# EAGLE design SparkFun_Artemis_OpenLog (EAGLE 9.5.2)
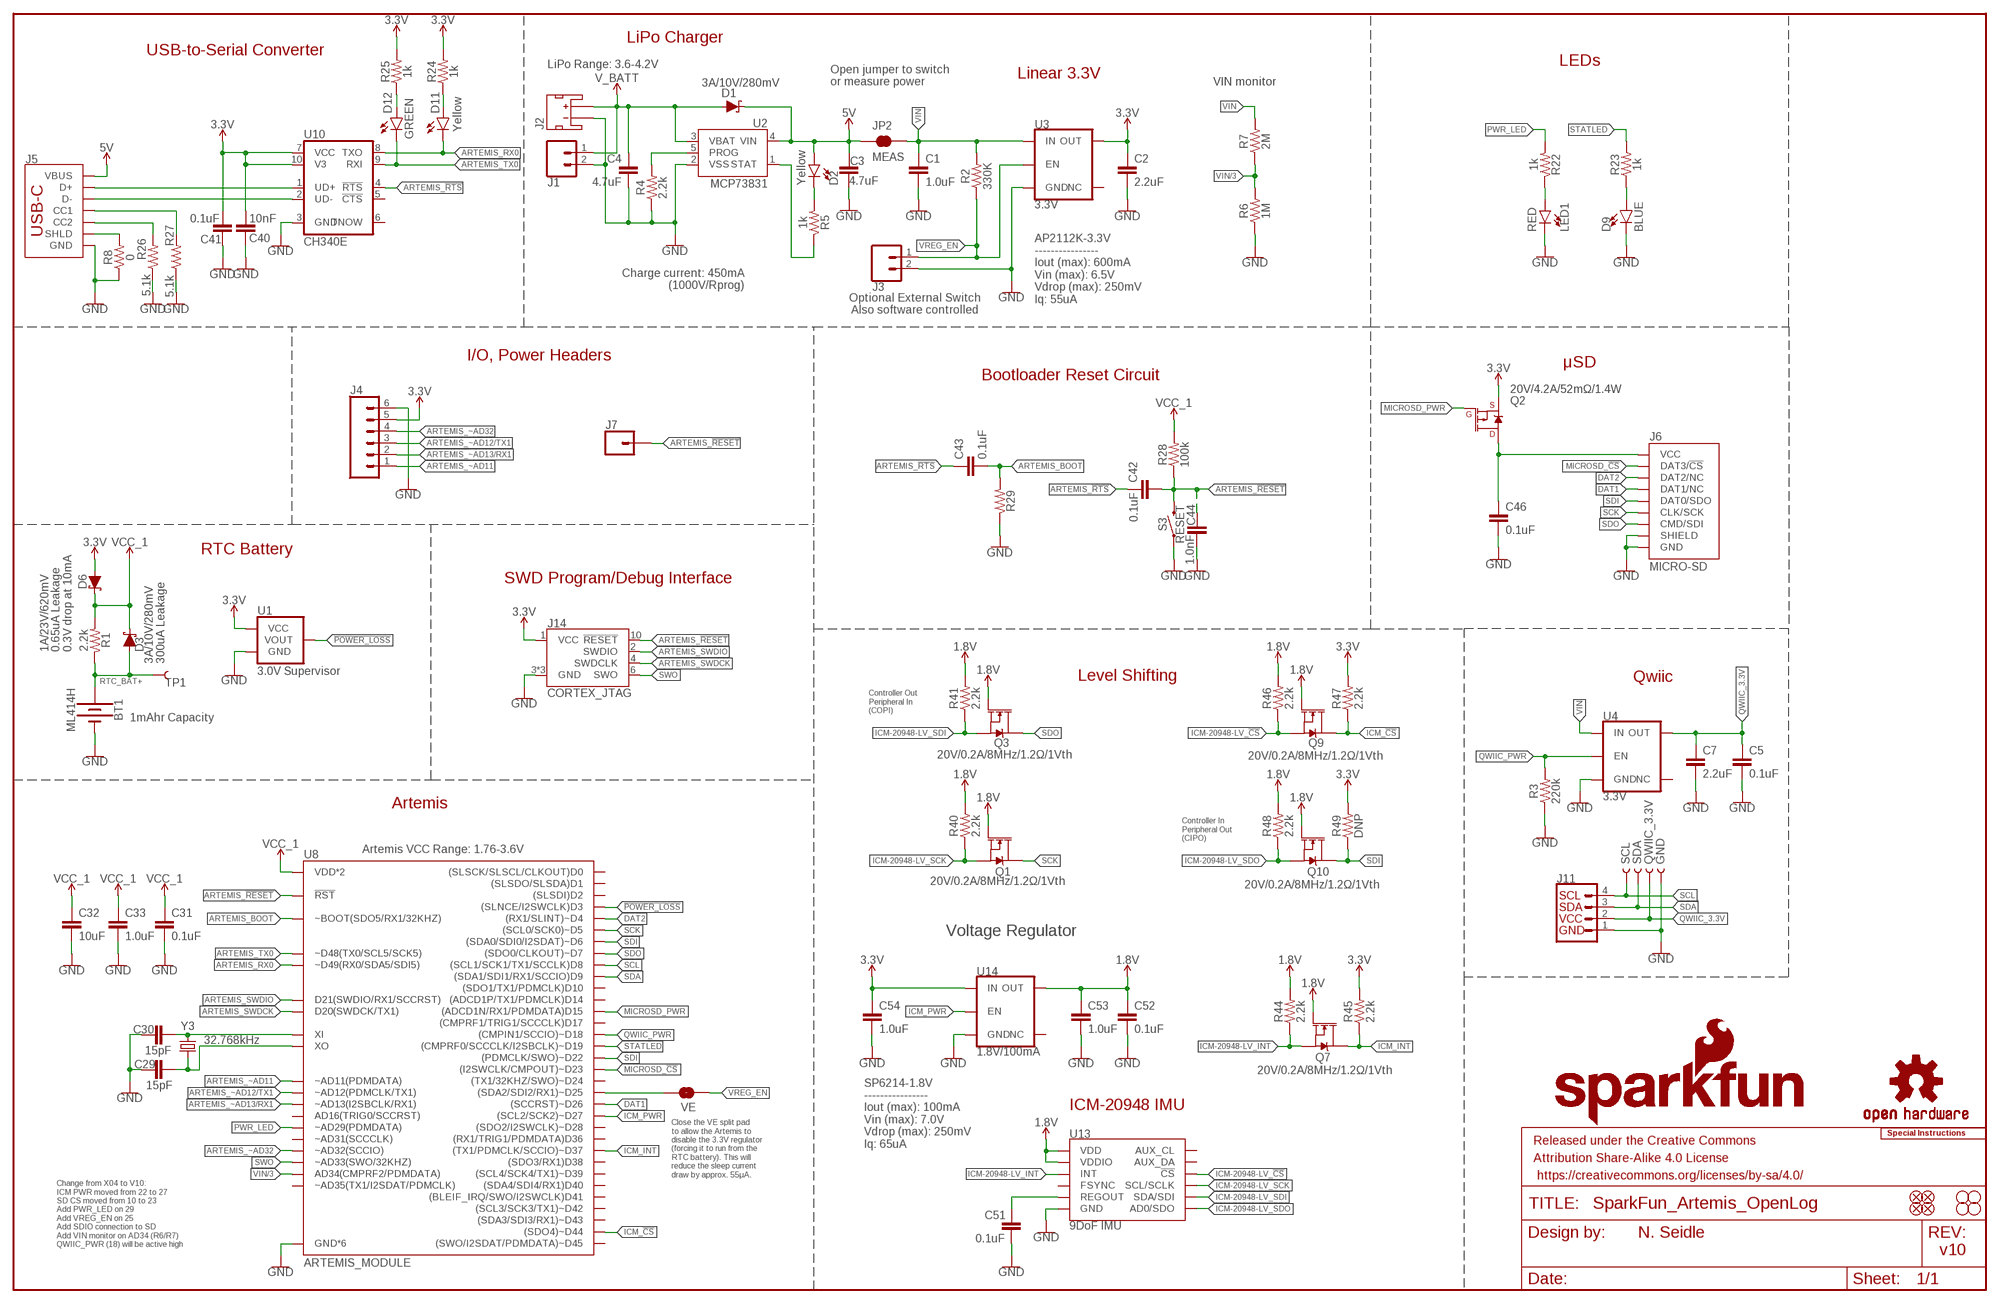
[diagram p0: schematic, sheet 1]

## Parts
BT1  ML414H  ML414H_IV01E_BATTERY  [ML414H_IV01E]
C1  1.0uF  1.0UF-0402T-16V-10%  [0402-TIGHT]
C2  2.2uF  2.2UF-0402_TIGHT-10V-10%-X5R  [0402-TIGHT]
C3  4.7uF  4.7UF-0402_TIGHT-6.3V-20%-X5R  [0402-TIGHT]
C4  4.7uF  4.7UF-0402_TIGHT-6.3V-20%-X5R  [0402-TIGHT]
C5  0.1uF  0.1UF-0402T-6.3V-10%-X7R  [0402-TIGHT]
C7  2.2uF  2.2UF-0402_TIGHT-10V-10%-X5R  [0402-TIGHT]
C29  15pF  15PF-0402T-50V-5%  [0402-TIGHT]
C30  15pF  15PF-0402T-50V-5%  [0402-TIGHT]
C31  0.1uF  0.1UF-0402T-16V-10%  [0402-TIGHT]
C32  10uF  10UF-0402T-6.3V-20%  [0402-TIGHT]
C33  1.0uF  1.0UF-0402T-16V-10%  [0402-TIGHT]
C40  10nF  10NF-0402T-25V-10%  [0402-TIGHT]
C41  0.1uF  0.1UF-0402T-16V-10%  [0402-TIGHT]
C42  0.1uF  0.1UF-0402T-16V-10%  [0402-TIGHT]
C43  0.1uF  0.1UF-0402T-16V-10%  [0402-TIGHT]
C44  1.0nF  1.0NF/1000PF-0402_TIGHT-50V-10%  [0402-TIGHT]
C46  0.1uF  0.1UF-0402T-16V-10%  [0402-TIGHT]
C51  0.1uF  0.1UF-0402T-16V-10%  [0402-TIGHT]
C52  0.1uF  0.1UF-0402T-16V-10%  [0402-TIGHT]
C53  1.0uF  1.0UF-0402T-16V-10%  [0402-TIGHT]
C54  1.0uF  1.0UF-0402T-16V-10%  [0402-TIGHT]
D1  3A/10V/280mV  DIODE-SCHOTTKY-BAT60A  [SOD-323]
D2  Yellow  LED-YELLOW0603  [LED-0603]
D3  3A/10V/280mV  DIODE-SCHOTTKY-BAT60A  [SOD-323]
D6  1A/23V/620mV  DIODE-SCHOTTKY-BAT20J  [SOD-323]
D9  BLUE  LED-BLUE0603  [LED-0603]
D11  Yellow  LED-YELLOW0603  [LED-0603]
D12  GREEN  LED-GREEN0603  [LED-0603]
FD1  FIDUCIAL1X2  [FIDUCIAL-1X2]
FD2  FIDUCIAL1X2  [FIDUCIAL-1X2]
FD3  FIDUCIAL1X2  [FIDUCIAL-1X2]
FD4  FIDUCIAL1X2  [FIDUCIAL-1X2]
FRAME1  FRAME-LEDGER  [CREATIVE_COMMONS]
GND  TEST-POINTTP_15TH_THRU  [TP_15TH]
H1  STAND-OFF  [STAND-OFF]
H2  STAND-OFF  [STAND-OFF]
H3  STAND-OFF  [STAND-OFF]
H4  STAND-OFF  [STAND-OFF]
J1  CONN_021X02_NO_SILK  [1X02_NO_SILK]
J2  JST_2MM_MALE  [JST-2-SMD]
J3  CONN_021X02_NO_SILK  [1X02_NO_SILK]
J4  CONN_06NO_SILK_NO_POP  [1X06_NO_SILK]
J5  USB_C_4-LAYER_PADS  [USB-C-16P_4LAYER-PADS]
J6  MICRO-SD  MICRO-SD-SDIOPUSH-PUSH  [MICRO-SD-SOCKET]
J7  CONN_01PTH_NO_SILK_YES_STOP  [1X01_NO_SILK]
J11  QWIIC_CONNECTORJS-1MM  [JST04_1MM_RA]
J14  CORTEX_JTAG  CORTEX_JTAG_DEBUG_MINIMUM_PTH  [2X5-PTH-1.27MM]
JP2  MEAS  JUMPER-COMBO_2_NC_TRACE  [COMBO-JUMPER_2_NC_TRACE]
LED1  RED  LED-RED0603  [LED-0603]
LOGO1  SFE_LOGO_NAME.1_INCH  [SFE_LOGO_NAME_.1]
LOGO2  OSHW-LOGOS  [OSHW-LOGO-S]
LOGO3  SPECIAL_INSTRUCTIONS-ORDERING  [ORDERING_INSTRUCTIONS]
LOGO4  SFE_LOGO_FLAME.1_INCH  [SFE_LOGO_FLAME_.1]
LOGO5  SFE_LOGO_FLAME.1_INCH  [SFE_LOGO_FLAME_.1]
Q1  20V/0.2A/8MHz/1.2Ω/1Vth  MOSFET-NCH-RE1C00UNTL  [SOT-416FL]
Q2  20V/4.2A/52mΩ/1.4W  MOSFET_PCH-DMG2305UX-7  [SOT23-3]
Q3  20V/0.2A/8MHz/1.2Ω/1Vth  MOSFET-NCH-RE1C00UNTL  [SOT-416FL]
Q7  20V/0.2A/8MHz/1.2Ω/1Vth  MOSFET-NCH-RE1C00UNTL  [SOT-416FL]
Q9  20V/0.2A/8MHz/1.2Ω/1Vth  MOSFET-NCH-RE1C00UNTL  [SOT-416FL]
Q10  20V/0.2A/8MHz/1.2Ω/1Vth  MOSFET-NCH-RE1C00UNTL  [SOT-416FL]
QWIIC_3.3V  TEST-POINTTP_15TH_THRU  [TP_15TH]
R1  2.2k  2.2KOHM-0402T-1/16W-1%  [0402-TIGHT]
R2  330K  330KOHM-0402T-1/16W-1%  [0402-TIGHT]
R3  220k  220KOHM-0402T-1/16W-1%  [0402-TIGHT]
R4  2.2k  2.2KOHM-0402T-1/16W-1%  [0402-TIGHT]
R5  1k  1KOHM-0402T-1/16W-1%  [0402-TIGHT]
R6  1M  1MOHM-0402T-1/16W-1%  [0402-TIGHT]
R7  2M  2MOHM-0402T-1/16W-1%  [0402-TIGHT]
R8  0  0OHM-0402T-1/10W  [0402-TIGHT]
R22  1k  1KOHM-0402T-1/16W-1%  [0402-TIGHT]
R23  1k  1KOHM-0402T-1/16W-1%  [0402-TIGHT]
R24  1k  1KOHM-0402T-1/16W-1%  [0402-TIGHT]
R25  1k  1KOHM-0402T-1/16W-1%  [0402-TIGHT]
R26  5.1k  5.1KOHM-0402T-1/16W-1%  [0402-TIGHT]
R27  5.1k  5.1KOHM-0402T-1/16W-1%  [0402-TIGHT]
R28  100k  100KOHM-0402T-1/16W-1%  [0402-TIGHT]
R29  220KOHM-0402T-1/16W-1%  [0402-TIGHT]
R40  2.2k  2.2KOHM-0402T-1/16W-1%  [0402-TIGHT]
R41  2.2k  2.2KOHM-0402T-1/16W-1%  [0402-TIGHT]
R44  2.2k  2.2KOHM-0402T-1/16W-1%  [0402-TIGHT]
R45  2.2k  2.2KOHM-0402T-1/16W-1%  [0402-TIGHT]
R46  2.2k  2.2KOHM-0402T-1/16W-1%  [0402-TIGHT]
R47  2.2k  2.2KOHM-0402T-1/16W-1%  [0402-TIGHT]
R48  2.2k  2.2KOHM-0402T-1/16W-1%  [0402-TIGHT]
R49  DNP  RESISTOR0402T  [0402-TIGHT]
S3  RESET  MOMENTARY-SWITCH-SPST-SMD-4.6X2.8MM  [TACTILE_SWITCH_SMD_4.6X2.8MM]
SCL  TEST-POINTTP_15TH_THRU  [TP_15TH]
SDA  TEST-POINTTP_15TH_THRU  [TP_15TH]
TP1  TEST-POINT3  [PAD.03X.03]
U1  3.0V Supervisor  V_SUPERVISOR  [SOT23-3]
U2  MCP73831  [SOT23-5]
U3  3.3V  V_REG_AP2112K-3.3V  [SOT23-5]
U4  3.3V  V_REG_AP2112K-3.3V  [SOT23-5]
U8  ARTEMIS_MODULE  ARTEMIS_MODULESMD  [ARTEMIS_FP]
U10  CH340E  CH340E_MSOP10  [MSOP10]
U13  9DoF IMU  ICM-20948  [QFN24-3X3-ICM-20948]
U14  1.8V/100mA  V_REG_SP6214-1.8V  [SC70]
VE  JUMPER-SMT_2_NO_SILK  [SMT-JUMPER_2_NO_SILK]
Y3  32.768kHz  CRYSTAL-32.768KHZSMD-3.2X1.5  [CRYSTAL-SMD-3.2X1.5MM]

## Nets
3.3V: C2.1 C40.1 C41.1 C54.1 D6.A J4.5 J14.1(VCC) Q2.2(S) R24.2 R25.2 R45.2 R47.2 R49.2 U1.3(VCC) U3.5(OUT) U10.7(VCC) U10.10(V3) U14.1(IN)
5V [Power]: C3.1 D1.C D2.A J5.VBUS1(VBUS) J5.VBUS2(VBUS) JP2.1 JP2.3 U2.4(VIN)
!POWER_LOSS!: U1.2(VOUT) U8.D3((SLNCE/I2SWCLK)D3)
ARTEMIS_!RESET: C42.2 C44.1 J7.1 J14.10(!RESET) R28.1 S3.3 S3.4 U8.~RST(!RST)
ARTEMIS_!RTS!: C42.1 C43.1 U10.4(!RTS)
ARTEMIS_BOOT: C43.2 R29.2 U8.BOOT(~BOOT(SDO5/RX1/32KHZ))
ARTEMIS_RX0: D11.C U8.RXI-0(~D49(RX0/SDA5/SDI5)) U10.8(TXO)
ARTEMIS_SWDCK: J14.4(SWDCLK) U8.SWDCK(D20(SWDCK/TX1))
ARTEMIS_SWDIO: J14.2(SWDIO) U8.SWDIO(D21(SWDIO/RX1/SCCRST))
ARTEMIS_TX0: D12.C U8.TXO-0(~D48(TX0/SCL5/SCK5)) U10.9(RXI)
ARTEMIS_~AD11: J4.1 U8.~AD11(~AD11(PDMDATA))
ARTEMIS_~AD12/TX1: J4.3 U8.~AD12(~AD12(PDMCLK/TX1))
ARTEMIS_~AD13/RX1: J4.2 U8.~AD13(~AD13(I2SBCLK/RX1))
ARTEMIS_~AD32: J4.4 U8.~AD32(~AD32(SCCIO))
CC3: J5.B5(CC2) R26.2
CC4: J5.A5(CC1) R27.2
CHG_LED: R5.1 U2.1(STAT)
D+2: J5.A6(D+) J5.B6(D+) U10.1(UD+)
D-2: J5.A7(D-) J5.B7(D-) U10.2(UD-)
DAT1: J6.DAT1(DAT1/NC) U8.~D26((SCCRST)~D26)
DAT2: J6.DAT2(DAT2/NC) U8.~D4((RX1/SLINT)~D4)
GND: BT1.- C1.2 C2.2 C3.2 C4.2 C5.2 C7.2 C29.1 C30.1 C31.1 C32.2 C33.2 C40.2 C41.2 C44.2 C46.2 C51.2 C52.2 C53.2 C54.2 D9.C GND.P$1 J1.2 J2.1(-) J3.2 J4.6 J5.GND J5.GND2(GND) J6.CD1(SHIELD) J6.GND J6.GND1(GND) J6.GND3(GND) J11.1 J14.3(GND) J14.5(GND) J14.9(GND) LED1.C R3.1 R4.1 R6.1 R8.1 R26.1 R27.1 R29.1 S3.1 S3.2 U1.1(GND) U2.2(VSS) U3.2(GND) U4.2(GND) U8.GND@1(GND*6) U8.GND@22(GND*6) U8.GND@38(GND*6) U8.GND@39(GND*6) U8.GND@47(GND*6) U8.GND@59(GND*6) U10.3(GND) U13.18(GND) U13.20(GND) U14.2(GND)
ICM-20948-LV_!CS!: Q9.2(S) R46.1 U13.22(!CS)
ICM-20948-LV_#_1.8V: C52.1 C53.1 Q1.1(G) Q3.1(G) Q7.1(G) Q9.1(G) Q10.1(G) R40.2 R41.2 R44.2 R46.2 R48.2 U13.8(VDDIO) U13.13(VDD) U14.5(OUT) ; supply symbol labelled 1.8V
ICM-20948-LV_INT: Q7.2(S) R44.1 U13.12(INT)
ICM-20948-LV_SCK: Q1.2(S) R40.1 U13.23(SCL/SCLK)
ICM-20948-LV_SDI: Q3.2(S) R41.1 U13.24(SDA/SDI)
ICM-20948-LV_SDO: Q10.2(S) R48.1 U13.9(AD0/SDO)
ICM_!CS!: Q9.3(D) R47.1 U8.~D44((SDO4)~D44)
ICM_INT: Q7.3(D) R45.1 U8.~D37((TX1/PDMCLK/SCCIO)~D37)
ICM_PWR: U8.~D27((SCL2/SCK2)~D27) U14.3(EN)
MICROSD_!CS!: J6.CS/DAT3(DAT3/!CS!) U8.~D23((I2SWCLK/CMPOUT)~D23)
MICROSD_PWR: Q2.1(G) U8.D15((ADCD1N/RX1/PDMDATA)D15)
N$1: J5.SHLD1(SHLD) J5.SHLD2(SHLD) J5.SHLD3(SHLD) J5.SHLD4(SHLD) R8.2
N$7: R4.2 U2.5(PROG)
N$11: D2.C R5.2
N$20: C29.2 U8.XO Y3.P$2
N$21: C30.2 U8.XI Y3.P$1
N$24: LED1.A R22.1
N$25: D9.A R23.1
N$26: D12.A R25.1
N$27: D11.A R24.1
N$30: C51.1 U13.10(REGOUT)
PWR_LED: R22.2 U8.~AD29(~AD29(PDMDATA))
QWIIC_3.3V: C5.1 C7.1 J11.2 QWIIC_3.3V.P$1 U4.5(OUT)
QWIIC_PWR: R3.2 U4.3(EN) U8.~D18((CMPIN1/SCCIO)~D18)
RTC_BAT+: BT1.+ D3.A R1.1 TP1.P$1
SCK: J6.SCLK(CLK/SCK) Q1.3(D) U8.~D5((SCL0/SCK0)~D5)
SCL: J11.4 SCL.P$1 U8.D8((SCL1/SCK1/TX1/SCCLK)D8)
SD_PWR: C46.1 J6.VCC Q2.3(D)
SDA: J11.3 SDA.P$1 U8.D9((SDA1/SDI1/RX1/SCCIO)D9)
SDI: J6.DO/DAT0(DAT0/SDO) Q10.3(D) R49.1 U8.~D6((SDA0/SDI0/I2SDAT)~D6) U8.~D22((PDMCLK/SWO)~D22)
SDO: J6.DI/CMD(CMD/SDI) Q3.3(D) U8.D7((SDO0/CLKOUT)~D7)
STATLED: R23.2 U8.~D19((CMPRF0/SCCCLK/I2SBCLK)~D19)
SWO: J14.6(SWO) U8.~AD33/SWO(~AD33(SWO/32KHZ))
V_BATT: C4.1 D1.A J1.1 J2.2(+) U2.3(VBAT)
VCC_1: C31.2 C32.1 C33.1 D3.C D6.C R1.2 R28.2 U8.VDD@36(VDD*2) U8.VDD@37(VDD*2)
VIN [Power]: C1.1 JP2.2 JP2.4 R2.2 R7.2 U3.1(IN) U4.1(IN)
VIN/3: R6.2 R7.1 U8.AD34(AD34(CMPRF2/PDMDATA))
VREG_EN: J3.1 R2.1 U3.3(EN) VE.2
VREG_EN1: U8.~D25((SDA2/SDI2/RX1)~D25) VE.1
Unconnected: J2.NC1(PAD1) J2.NC2(PAD2) U3.4(NC) U4.4(NC) U8.AD16(AD16(TRIG0/SCCRST)) U8.D0((SLSCK/SLSCL/CLKOUT)D0) U8.D1((SLSDO/SLSDA)D1) U8.D2((SLSDI)D2) U8.D10((SDO1/TX1/PDMCLK)D10) U8.D14((ADCD1P/TX1/PDMCLK)D14) U8.D17((CMPRF1/TRIG1/SCCCLK)D17) U8.D36((RX1/TRIG1/PDMDATA)D36) U8.D38((SDO3/RX1)D38) U8.D40((SDA4/SDI4/RX1)D40) U8.D41((BLEIF_IRQ/SWO/I2SWCLK)D41) U8.~AD31(~AD31(SCCCLK)) U8.~AD35(~AD35(TX1/I2SDAT/PDMCLK)) U8.~D24((TX1/32KHZ/SWO)~D24) U8.~D28((SDO2/I2SWCLK)~D28) U8.~D39((SCL4/SCK4/TX1)~D39) U8.~D42((SCL3/SCK3/TX1)~D42) U8.~D43((SDA3/SDI3/RX1)~D43) U8.~D45((SWO/I2SDAT/PDMDATA)~D45) U10.5(!CTS) U10.6(TNOW) U13.7(AUX_CL) U13.11(FSYNC) U13.21(AUX_DA) U14.4(NC)

## Notes on the sheet
- LiPo Charger
- USB-to-Serial Converter
- LiPo Range: 3.6-4.2V | LEDs
- Linear 3.3V
- Open jumper to switch
  or measure power
- VIN monitor
- AP2112K-3.3V
  ----------------
  Iout (max): 600mA
  Vin (max): 6.5V
  Vdrop (max): 250mV
  Iq: 55uA
- Charge current: 450mA
  (1000V/Rprog)
- Optional External Switch
  Also software controlled
- I/O, Power Headers
- μSD
- Bootloader Reset Circuit
- RTC Battery
- SWD Program/Debug Interface
- 0.65uA Leakage
  0.3V drop at 10mA
- 300uA Leakage
- Level Shifting | Qwiic
- Controller Out
  Peripheral In
  (COPI)
- 1mAhr Capacity
- Artemis
- Controller In
  Peripheral Out
  (CIPO)
- Artemis VCC Range: 1.76-3.6V
- Voltage Regulator
- SP6214-1.8V
  ----------------
  Iout (max): 100mA
  Vin (max): 7.0V
  Vdrop (max): 250mV
  Iq: 65uA
- ICM-20948 IMU
- Close the VE split pad
  to allow the Artemis to
  disable the 3.3V regulator
  (forcing it to run from the
  RTC battery). This will
  reduce the sleep current
  draw by approx. 55μA.
- N. Seidle
- Change from X04 to V10:
  ICM PWR moved from 22 to 27
  SD CS moved from 10 to 23
  Add PWR_LED on 29
  Add VREG_EN on 25
  Add SDIO connection to SD
  Add VIN monitor on AD34 (R6/R7)
  QWIIC_PWR (18) will be active high
- v10

## Library data of the parts
BT1 = SparkFun-Batteries:ML414H_IV01E_BATTERY: SEIKO ML414H-IV01E Reflowable Lithium Battery ML414H is a rechargeable, coin type battery with features such as Pb-free reflowable (Peak temperature: 260 C) and high temperature heat resistance. Battery Characteristics: 3.1V max voltage Voff is 2V 1mAH 3k series resistor with battery 72 hour charge time from 2.0-3.1V 2.3-2.8V initial charge; PROD_ID: BATT-14267
C1 C33 C53 C54 = SparkFun-Capacitors:1.0UF: 1µF ceramic capacitors A capacitor is a passive two-terminal electrical component used to store electrical energy temporarily in an electric field.; PROD_ID: CAP-12417
C2 C7 = SparkFun-Capacitors:2.2UF: 2.2µF ceramic capacitors A capacitor is a passive two-terminal electrical component used to store electrical energy temporarily in an electric field.; PROD_ID: CAP-14232
C3 C4 = SparkFun-Capacitors:4.7UF: 4.7µF ceramic capacitors A capacitor is a passive two-terminal electrical component used to store electrical energy temporarily in an electric field.; PROD_ID: CAP-14240
C5 = SparkFun-Capacitors:0.1UF: 0.1µF ceramic capacitors A capacitor is a passive two-terminal electrical component used to store electrical energy temporarily in an electric field.; PROD_ID: CAP-14993
C29 C30 = SparkFun-Capacitors:15PF: 15pF ceramic capacitors A capacitor is a passive two-terminal electrical component used to store electrical energy temporarily in an electric field.; PROD_ID: CAP-13063
C31 C41-C43 C46 C51 C52 = SparkFun-Capacitors:0.1UF: 0.1µF ceramic capacitors A capacitor is a passive two-terminal electrical component used to store electrical energy temporarily in an electric field.; PROD_ID: CAP-12416
C32 = SparkFun-Capacitors:10UF: 10.0µF ceramic capacitors A capacitor is a passive two-terminal electrical component used to store electrical energy temporarily in an electric field.; PROD_ID: CAP-14848
C40 = SparkFun-Capacitors:10NF: 0.01uF/10nF/10,000pF ceramic capacitors A capacitor is a passive two-terminal electrical component used to store electrical energy temporarily in an electric field. CAP-09321; PROD_ID: CAP-14847
C44 = SparkFun-Capacitors:1.0NF/1000PF: 1nF/1,000pF ceramic capacitors A capacitor is a passive two-terminal electrical component used to store electrical energy temporarily in an electric field.; PROD_ID: CAP-14280
D1 D3 = SparkFun-DiscreteSemi:DIODE-SCHOTTKY: Schottky diode A Schottky diode is a semiconductor diode which has a low forward voltage drop and a very fast switching action.; PROD_ID: DIO-14072
D2 D11 = SparkFun-LED:LED-YELLOW: Yellow SMD LED Used in manufacturing several products at SparkFun. Packages: 0603 - SMD 0603 package[Product Link] <http://www.kingbrightusa.com/product.asp?catalog_name=LED&product_id=APT1608SYCK> 0603 -SMART - SMART SMD 0603 package (more efficient/more expensive) [Product Link] <http://www.osram-os.com/osram_os/en/products/product-catalog/led-light-emitting-diodes/smartled-0603/ly-l29k/index.jsp> LilyPad - SMD1206 package[Product Datasheet] <https://www.sparkfun.com/datasheets/DevTools/LilyPad/Q150YUS4.pdf> SparkFun Products: Blynk Board <https://www.sparkfun.com/products/13794> IOIO-OTG <https://www.sparkfun.com/products/13613> XBee Explorer Serial <https://www.sparkfun.com/products/13225>; PROD_ID: DIO-09003
D6 = SparkFun-DiscreteSemi:DIODE-SCHOTTKY: Schottky diode A Schottky diode is a semiconductor diode which has a low forward voltage drop and a very fast switching action.; PROD_ID: DIO-11623
D9 = SparkFun-LED:LED-BLUE: Blue SMD LED Used in manufacturing of various products at SparkFun Packages: 0603 - SMD 0603 package [Product Link] <http://www.digikey.com/product-detail/en/SMLE12BC7TT86/511-1589-2-ND/1641808> 1206 - SMD1206 package [Product Link] <http://www.digikey.com/product-detail/en/lite-on-inc/LTST-C150TBKT/160-1643-1-ND/573584> SparkFun Products: ESP8266 Thing-Dev Board <https://www.sparkfun.com/products/13711> RedBoard <https://www.sparkfun.com/products/12757>; PROD_ID: DIO-08575
D12 = SparkFun-LED:LED-GREEN: Green SMD LED Used in manufacturing of various products at SparkFun Packages: 0603 - SMD 0603 package [Product Link] <http://www.futureelectronics.com/en/technologies/semiconductors/optoelectronics/leds/Pages/9894312-LTST-C190GKT.aspx?CrossPart=HSMG-C190&IM=0> LilyPad 1206 - SMD1206 LilyPad package [Product Link] <http://www.futureelectronics.com/en/Technologies/Product.aspx?ProductID=IN150NGHARVATEKCORPORATION2049943&IM=0> 1206 - SMD1206 package [Product Link] <http://www.futureelectronics.com/en/technologies/semiconductors/optoelectronics/leds/Pages/8315665-LTST-C150KGKT.aspx?IM=0> 1206 Bottom Mount -SMD 1206 Bottom Mount [Product Link] <http://www.digikey.com/product-detail/en/lite-on-inc/LTST-C230KGKT/160-1456-1-ND/386854> SparkFun Products: Pro Mini 328 -5V <https://www.sparkfun.com/products/821> RedBoard <https://www.sparkfun.com/products/12757> MP3 Trigger <https://www.sparkfun.com/products/13720> Makey Makey <https://www.sparkfun.com/products/11076>; PROD_ID: DIO-00821
FD1-FD4 = SparkFun-Aesthetics:FIDUCIAL: Fiducial Alignment Points Point-of-reference for pick-and-place machines and other optical instruments.
FRAME1 = SparkFun-Aesthetics:FRAME-LEDGER: Schematic Frame - Ledger Standard 11x14 US Ledger frame
GND QWIIC_3.3V SCL SDA TP1 = SparkFun-Connectors:TEST-POINT: SparkFun Test Points Bare copper test points for troubleshooting or In-Circuit-Testing. These are used by our Production team for verifying production board runs using pogo-pins on test beds. SparkFun Products: SparkFun LSM9DS1 Breakout <https://www.sparkfun.com/products/13284> SparkFun PSOC <https://www.sparkfun.com/products/13714> SparkFun Load Cell Amplifier <https://www.sparkfun.com/products/13879>
H1-H4 = SparkFun-Hardware:STAND-OFF: Stand Off Drill holes for mechanically mounting via screws, standoffs, etc. Note: Use the keepout ring to avoid running the screw head into surrounding components. Variant Overviews STAND-OFF - Mechanical footprint for a #4 phillips button head screw. STAND-OFF-TIGHT - Mechanical footprint for a #4 phillips button head screw, Example SparkFun Products Screw - Phillips Head (1/4", 4-40, 10 pack) <https://www.sparkfun.com/products/10453> (PRT-10453) Screw - Phillips Head (1/2", 4-40, 10 pack) <https://www.sparkfun.com/products/10452> (PRT-10452) Screw - Phillips Head (3/4", 4-40, 10 pack) <https://www.sparkfun.com/products/10451> (PRT-10451) Screw - Phillips Head (1", 4-40, 10 pack) <https://www.sparkfun.com/products/10450> (PRT-10450)
J1 J3 = SparkFun-Connectors:CONN_02: Multi connection point. Often used as Generic Header-pin footprint for 0.1 inch spaced/style header connections On any of the 0.1 inch spaced packages, you can populate with these: Break Away Headers - Straight <https://www.sparkfun.com/products/116> (PRT-00116) Break Away Male Headers - Right Angle <https://www.sparkfun.com/products/553> (PRT-00553) Female Headers <https://www.sparkfun.com/products/115> (PRT-00115) Break Away Headers - Machine Pin <https://www.sparkfun.com/products/117> (PRT-00117) Break Away Female Headers - Swiss Machine Pin <https://www.sparkfun.com/products/743> (PRT-00743) For SCREWTERMINALS and SPRING TERMINALS visit here: Screw Terimnals on SparkFun.com <https://www.sparkfun.com/search/results?term=Screw+Terminals> (5mm/3.5mm/2.54mm spacing) This device is also useful as a general connection point to wire up your design to another part of your project. Our various solder wires solder well into these plated through hole pads. Hook-Up Wire - Assortment (Stranded, 22 AWG) <https://www.sparkfun.com/products/11375> (PRT-11375) Hook-Up Wire - Assortment (Solid Core, 22 AWG) <https://www.sparkfun.com/products/11367> (PRT-11367) View the entire wire category on our website here <https://www.sparkfun.com/categories/141> Special notes: Molex polarized connector foot print use with: PRT-08233 with associated crimp pins and housings. 2.54_SCREWTERM for use with PRT-10571. 3.5mm Screw Terminal footprints for PRT-08084 5mm Screw Terminal footprints for use with PRT-08432
J2 = SparkFun-Connectors:JST_2MM_MALE: JST 2MM MALE RA CONNECTOR Two pin, compact surface mount connector. Commonly used as a battery input connection point. We really like the solid locking feeling and high current rating on these small connectors. We use these all the time as battery connectors. Mates to single-cell LiPo batteries. Here is the connector we sell at SparkFun: JST Right Angle Connector - White <https://www.sparkfun.com/products/8612> (PRT-08612) Datasheet <http://www.sparkfun.com/datasheets/Prototyping/Connectors/JST-Horizontal.pdf> It was used on these SparkFun products: SparkFun MOSFET Power Controller <https://www.sparkfun.com/products/11214> (PRT-11214) SparkFun Battery Babysitter - LiPo Battery Manager <https://www.sparkfun.com/products/13777> (PRT-13777) And many, many others that required a lipo battery connection.; PROD_ID: CONN-11443; SF_ID: PRT-08612
J4 = SparkFun-Connectors:CONN_06: Multi connection point. Often used as Generic Header-pin footprint for 0.1 inch spaced/style header connections On any of the 0.1 inch spaced packages, you can populate with these: Break Away Headers - Straight <https://www.sparkfun.com/products/116> (PRT-00116) Break Away Male Headers - Right Angle <https://www.sparkfun.com/products/553> (PRT-00553) Female Headers <https://www.sparkfun.com/products/115> (PRT-00115) Break Away Headers - Machine Pin <https://www.sparkfun.com/products/117> (PRT-00117) Break Away Female Headers - Swiss Machine Pin <https://www.sparkfun.com/products/743> (PRT-00743) Arduino Stackable Header - 6 Pin <https://www.sparkfun.com/products/9280> (PRT-09280) For SCREWTERMINALS and SPRING TERMINALS visit here: Screw Terimnals on SparkFun.com <https://www.sparkfun.com/search/results?term=Screw+Terminals> (5mm/3.5mm/2.54mm spacing) This device is also useful as a general connection point to wire up your design to another part of your project. Our various solder wires solder well into these plated through hole pads. Hook-Up Wire - Assortment (Stranded, 22 AWG) <https://www.sparkfun.com/products/11375> (PRT-11375) Hook-Up Wire - Assortment (Solid Core, 22 AWG) <https://www.sparkfun.com/products/11367> (PRT-11367) View the entire wire category on our website here <https://www.sparkfun.com/categories/141>
J5 = SparkFun-Connectors:USB_C: USB Type C 16Pin Connector Super Speed pins not available on the 16-pin purely SMD connector so this part is best for USB 2.0 implementations. D1 and D2 are tied together enabling D+/- no matter which way the cable is plugged into the connector. The two channel configuration pins (CC1/2) are exposed. These are normally connected to ground via 5.1k resistors but can be reconfigured for high current/high power applications.; PROD_ID: CONN-14122
J6 = SparkFun-Connectors:MICRO-SD-SDIO: microSD Socket for Transflash Push-push type µSD socket. tDoc lines correctly indicate media card edge positions when inserting (unlocked, locked, depressed). NOTE: CD1 and CD2 are connected internally, and the default detect state of the socket is detect pin to ground. SparkFun Products: WAV Trigger <https://www.sparkfun.com/products/13660> CAN-Bus Shield <https://www.sparkfun.com/products/13262> SparkFun Level Shifing microSD Breakout <https://www.sparkfun.com/products/13743>; PROD_ID: CONN-07820
J7 = SparkFun-Connectors:CONN_01: Single connection point. Often used as Generic Header-pin footprint for 0.1 inch spaced/style header connections On any of the 0.1 inch spaced packages, you can populate with these: Break Away Headers - Straight <https://www.sparkfun.com/products/116> (PRT-00116) Break Away Male Headers - Right Angle <https://www.sparkfun.com/products/553> (PRT-00553) Female Headers <https://www.sparkfun.com/products/115> (PRT-00115) Break Away Headers - Machine Pin <https://www.sparkfun.com/products/117> (PRT-00117) Break Away Female Headers - Swiss Machine Pin <https://www.sparkfun.com/products/743> (PRT-00743) This device is also useful as a general connection point to wire up your design to another part of your project. Our various solder wires solder well into these plated through hole pads. Hook-Up Wire - Assortment (Stranded, 22 AWG) <https://www.sparkfun.com/products/11375> (PRT-11375) Hook-Up Wire - Assortment (Solid Core, 22 AWG) <https://www.sparkfun.com/products/11367> (PRT-11367) View the entire wire category on our website here <https://www.sparkfun.com/categories/141> Special notes: SMTSO-256-ET is a "flush mount" nut for a 4-40 screw. We mostly use this on specialty testbeds; it is a nice way to connect hardware to your PCB at an adjustable hieght. Also note, the SNAP packages are for using a snappable style connector. We sell a baggie of snaps and they are also used on two LilyPad designs: Snap Assortment - 30 pack (male and female) <https://www.sparkfun.com/products/11347> (DEV-11347) LilyPad Arduino SimpleSnap <https://www.sparkfun.com/products/10941> (DEV-10941) LilyPad SimpleSnap Protoboard <https://www.sparkfun.com/products/10940> (DEV-10940)
J11 = SparkFun-Connectors:QWIIC_CONNECTOR: SparkFun I2C Standard Qwiic Connector An SMD 1mm pitch JST connector makes it easy and quick (get it? Qwiic?) to connect I2C devices to each other. The Qwiic system <http://www.sparkfun.com/qwiic> enables fast and solderless connection between popular platforms and various sensors and actuators. We carry 200mm <https://www.sparkfun.com/products/14204>, 100mm <https://www.sparkfun.com/products/14205>, 50mm <https://www.sparkfun.com/products/14206>, and breadboard friendly <https://www.sparkfun.com/products/14207> Qwiic cables. We also offer 10 pcs strips <https://www.sparkfun.com/products/14323> the SMD connectors.; PROD_ID: CONN-13694; VALUE: QWIIC_RIGHT_ANGLE
J14 = SparkFun-Connectors:CORTEX_JTAG_DEBUG_MINIMUM: Cortex Debug Connector - 10 pin Supports JTAG debug, Serial Wire debug, and Serial Wire Viewer. PTH and SMD connector options available. General Connector Information <http://infocenter.arm.com/help/topic/com.arm.doc.faqs/attached/13634/cortex_debug_connectors.pdf> Products: PTH Connector <http://www.digikey.com/product-detail/en/cnc-tech/3220-10-0100-00/1175-1627-ND/3883661> -via Digi-Key SparkFun PSoc <https://www.sparkfun.com/products/13229> SparkFun T <https://www.sparkfun.com/products/13810>
JP2 = SparkFun-Jumpers:JUMPER-COMBO_2_NC_TRACE
LED1 = SparkFun-LED:LED-RED: Red SMD LED Used in manufacturing of most products at SparkFun Packages: 0603 - SMD 0603 package [Product Link] <http://docs.avagotech.com/docs/AV02-0551EN> 0603 SMART - SMD 0603 SMART package ( more efficient and expensive)[Product Link] <http://www.osram-os.com/Graphics/XPic2/00077099_0.pdf> 1206 - SMD1206 package [Product Link] <https://www.sparkfun.com/datasheets/DevTools/LilyPad/Q150OVS4.pdff> SparkFun Products: Pro Mini 328 -5V <https://www.sparkfun.com/products/821> RedBoard <https://www.sparkfun.com/products/12757> IOIO-OTG <https://www.sparkfun.com/products/13613>; PROD_ID: DIO-00819
LOGO1 = SparkFun-Aesthetics:SFE_LOGO_NAME: SparkFun Font Logo This is the SparkFun name logo. The logo on the schematic will always be the same size; the package variant is the height of the flame part of the logo (or the height the flame would be, if it were drawn). Default layer for the logo on the board is tSilk.
LOGO2 = SparkFun-Aesthetics:OSHW-LOGO: Open-Source Hardware (OSHW) Logo This logo indicates the piece of hardware it is found on incorporates a OSHW license and/or adheres to the definition of open source hardware found here: http://freedomdefined.org/OSHW
LOGO3 = SparkFun-Aesthetics:SPECIAL_INSTRUCTIONS: Special Ordering/Production Instructions Alert Symbol for special PCB ordering instructions or unique production process warnings. Ordering Instructions Production Instructions Types of information that should be added to box: Copper weight Soldermask color Silk color PCB thickness Number of layers PCB Standard: 1.6mm FR4 1 oz copper immersion silver plating red soldermask white silkscreen Types of information that should be added to box: Special wash requirements Depaneling instructions Humidification Glue curing Default text settings: 0.07 inch 9% ratio 50% line distance
LOGO4 LOGO5 = SparkFun-Aesthetics:SFE_LOGO_FLAME: SparkFun Flame Logo This is the SparkFun flame logo. The logo on the schematic will always be the same size; the package variant is the height of the flame. Default layer for the logo on the board is tSilk.
Q1 Q3 Q7 Q9 Q10 = SparkFun-DiscreteSemi:MOSFET-NCH: N-channel MOSFETs Voltage controlled devices that allow control of high current outputs. SparkFun Products: SparkFun OpenScale <https://www.sparkfun.com/products/13261> SparkFun Digital Sandbox <https://www.sparkfun.com/products/12651> SparkFun Monster Moto Shield <https://www.sparkfun.com/products/10182> SparkFun MOSFET Power Controller <https://www.sparkfun.com/products/11214>; PROD_ID: TRANS-14399
Q2 = SparkFun-DiscreteSemi:MOSFET_PCH: P-channel MOSFETs Voltage controlled devices that allow control of high current outputs. SparkFun Products: SparkFun ESP32 Thing <https://www.sparkfun.com/products/13907> SparkFun ESP8266 Thing <https://www.sparkfun.com/products/13231> SparkFun Pi Servo HAT V2 <https://www.sparkfun.com/products/15316> DMG2305UX-7 (20V/4.2A/SOT23-3); PROD_ID: TRAN-14388
R1 R4 R40 R41 R44-R48 = SparkFun-Resistors:2.2KOHM: 2.2kΩ resistor A resistor is a passive two-terminal electrical component that implements electrical resistance as a circuit element. Resistors act to reduce current flow, and, at the same time, act to lower voltage levels within circuits. - Wikipedia; PROD_ID: RES-14341
R2 = New_Parts:330KOHM: 330kΩ resistor A resistor is a passive two-terminal electrical component that implements electrical resistance as a circuit element. Resistors act to reduce current flow, and, at the same time, act to lower voltage levels within circuits. - Wikipedia; PROD_ID: RES-15187
R3 R29 = SparkFun-Resistors:220KOHM: 220kΩ resistor A resistor is a passive two-terminal electrical component that implements electrical resistance as a circuit element. Resistors act to reduce current flow, and, at the same time, act to lower voltage levels within circuits. - Wikipedia; PROD_ID: RES-15094
R5 R22-R25 = SparkFun-Resistors:1KOHM: 1kΩ resistor A resistor is a passive two-terminal electrical component that implements electrical resistance as a circuit element. Resistors act to reduce current flow, and, at the same time, act to lower voltage levels within circuits. - Wikipedia; PROD_ID: RES-14342
R6 = New_Parts:1MOHM: 1MΩ resistor A resistor is a passive two-terminal electrical component that implements electrical resistance as a circuit element. Resistors act to reduce current flow, and, at the same time, act to lower voltage levels within circuits. - Wikipedia; PROD_ID: RES-15185
R7 = New_Parts:2MOHM: 2MΩ resistor A resistor is a passive two-terminal electrical component that implements electrical resistance as a circuit element. Resistors act to reduce current flow, and, at the same time, act to lower voltage levels within circuits. - Wikipedia; PROD_ID: RES-15186
R8 = SparkFun-Resistors:0OHM: 0Ω resistor A resistor is a passive two-terminal electrical component that implements electrical resistance as a circuit element. Resistors act to reduce current flow, and, at the same time, act to lower voltage levels within circuits. - Wikipedia; PROD_ID: RES-14244
R26 R27 = SparkFun-Resistors:5.1KOHM; PROD_ID: RES-14340
R28 = SparkFun-Resistors:100KOHM: 100kΩ resistor A resistor is a passive two-terminal electrical component that implements electrical resistance as a circuit element. Resistors act to reduce current flow, and, at the same time, act to lower voltage levels within circuits. - Wikipedia; PROD_ID: RES-13495
R49 = SparkFun-Resistors:RESISTOR: Generic Resistor Package
S3 = SparkFun-Switches:MOMENTARY-SWITCH-SPST: Momentary Switch (Pushbutton) - SPST Normally-open (NO) SPST momentary switches (buttons, pushbuttons). Variants PTH-12MM - 12mm square, through-hole Momentary Pushbutton Switch - 12mm Square <https://www.sparkfun.com/products/9190> (COM-09190) PTH-6.0MM, PTH-6.0MM-KIT - 6.0mm square, through-hole Mini Pushbutton Switch <https://www.sparkfun.com/products/97> (COM-00097) KIT package intended for soldering kit's - only one side of pads' copper is exposed. PTH-RIGHT-ANGLE-KIT - Right-angle, through-hole Right Angle Tactile Button <https://www.sparkfun.com/products/10791> - Used on SparkFun BigTime Watch Kit <https://www.sparkfun.com/products/11734> SMD-12MM - 12mm square, surface-mount Tactile Button - SMD (12mm) <https://www.sparkfun.com/products/12993> (COM-12993) Used on SparkFun PicoBoard <https://www.sparkfun.com/products/11888> SMD-4.5MM - 4.5mm Square Trackball Switch Used on SparkFun Blackberry Trackballer Breakout <https://www.sparkfun.com/products/13169> SMD-4.6MMX2.8MM - 4.60mm x 2.80mm, surface mount Used on SparkFun SAMD21 Mini Breakout <https://www.sparkfun.com/products/13664> SMD-5.2MM, SMD-5.2-REDUNDANT - 5.2mm square, surface-mount Mini Pushbutton Switch - SMD <https://www.sparkfun.com/products/8720> (COM-08720) Used on Arduino Pro Mini <https://www.sparkfun.com/products/11114> REDUNDANT package connects both switch circuits together SMD-6.0X3.5MM - 6.0 x 3.5mm, surface mount Momentary Reset Switch SMD <https://www.sparkfun.com/products/8229> (COM-08229) SMD-6.2MM-TALL - 6.2mm square, surface mount Tactile Button - SMD (6mm) <https://www.sparkfun.com/products/12992> Used on SparkFun Digital Sandbox <https://www.sparkfun.com/products/12651> SMD-RIGHT-ANGLE - Right-angle, surface mount Used on SparkFun Block for Intel® Edison - Arduino <https://www.sparkfun.com/products/13036>; PROD_ID: SWCH-13065
U1 = SparkFun-IC-Power:V_SUPERVISOR: BD48xxx - Voltage Detector IC ROHM’s BD48xxx and BD49xxx series are highly accurate, low-current Voltage Detector IC series. The family includes BD48xxx devices with N-channel open drain output and BD49xxx devices with CMOS output. The devices are available for specific detection voltages ranging from 2.3V to 6.0V in increments of 0.1V.; PROD_ID: IC-14809
U2 = SparkFun-IC-Power:MCP73831: MCP73831T Li-Ion, Li-Pol Controller Miniature single cell, fully integrated Li-Ion, Li-polymer charge management controller Datasheet <http://ww1.microchip.com/downloads/en/DeviceDoc/20001984g.pdf> SparkFun Products: SparkFun ESP32 Thing <https://www.sparkfun.com/products/13907> SparkFun 9DoF Razor IMU M0 <https://www.sparkfun.com/products/14001>; PROD_ID: IC-09995
U3 U4 = SparkFun-IC-Power:V_REG_AP2112: AP2112 - 600mA CMOS LDO Regulator w/ Enable The AP2112 is CMOS process low dropout linear regulator with enable function, the regulator delivers a guaranteed 600mA (min.) continuous load current. Features Output Voltage Accuracy: ±1.5% Output Current: 600mA (Min.) Foldback Short Current Protection: 50mA Enable Function to Turn ON/OFF VOUT Low Dropout Voltage (3.3V): 250mV (Typ.) @IOUT=600mA Excellent Load Regulation: 0.2%/A (Typ.) Excellent Line Regulation: 0.02%/V (Typ.) Low Quiescent Current: 55μA (Typ.) Low Standby Current: 0.01μA (Typ.) Low Output Noise: 50μVRMS PSRR: 100Hz -65dB, 1kHz -65dB OTSD Protection Stable with 1.0μF Flexible Cap: Ceramic, Tantalum and Aluminum Electrolytic Operation Temperature Range: -40°C to 85°C ESD: MM 400V, HBM 4000V; PROD_ID: VREG-12457
U8 = SparkFun-IC-Microcontroller:ARTEMIS_MODULE: Description: The Artemis Module from SparkFun is a Cortex-M4F with BLE 5.0 running up to 96MHz and with as low power as 6uA per MHz (less than 5mW). This is the world's first module to bridge the market between hobbyists and consumer products. We've packaged all the power of a modern microcontroller into a module that is both extremely easy to use but is mass-market ready. The flexibility of the Artemis module starts with our [Arduino core](https://github.com/sparkfun/Arduino_Apollo3). You can program and use the Artemis module just like you would an Uno or any other Arduino. Time to first blink is just 5 minutes away! We built the core from the ground up, making it fast and as light weight as possible.; PROD_ID: SUB-14402
U10 = SparkFun-IC-Comms:CH340E; PROD_ID: IC-14135
U13 = SparkFun-Sensors:ICM-20948: ICM-20948 9 Degree of Freedom IMU World’s lowest power 9-axis MotionTracking device that is ideally suited for smartphones, tablets, wearable sensors, and IoT applications. Includes onboard Digital Motion Processor to offload computations from the host processor Datasheet <https://cdn.sparkfun.com/assets/learn_tutorials/5/5/0/MPU9250REV1.0.pdf> SparkFun Products: SparkFun IMU Breakout - ICM-20948 <https://www.sparkfun.com/products/15182>; PROD_ID: IC-14247
U14 = SparkFun-IC-Power:V_REG_SP6214: Voltage Regulator - SP6214 SP6214 Series SC-70-5 Micropower SC-70 100 mA CMOS LDO Regulator Datasheet <https://www.exar.com/content/document.ashx?id=654> SparkFun Products: MP3 Trigger <https://www.sparkfun.com/products/13720> SparkFun Particle Sensor Breakout <https://www.sparkfun.com/products/14045>; PROD_ID: VREG-08428
VE = SparkFun-Jumpers:JUMPER-SMT_2_NO: Normally open jumper This jumper has two pads in close proximity to each other. Apply solder to close the connection. Round pads are easier to solder for beginners, but are a lot larger. SparkFun Product that uses the round pads: SparkFun EL Sequencer <https://www.sparkfun.com/products/12781>
Y3 = SparkFun-Clocks:CRYSTAL-32.768KHZ: 32.768kHz Crystal Frequency: 32.768kHz Frequency Stability: ±20ppm Load Capacitance: 12.5pF (PTH-2X6 & SMD-3.2X1.5), 6pF (SMD-2X6) SparkFun Products: SparkFun BigTime Watch Kit <https://www.sparkfun.com/products/11734> SparkFun nRF52832 Breakout <https://www.sparkfun.com/products/13990> SparkFun Real Time Clock Module <https://www.sparkfun.com/products/12708>; PROD_ID: XTAL-13062

## Net classes
1 Power: width 0.457 mm

## Board
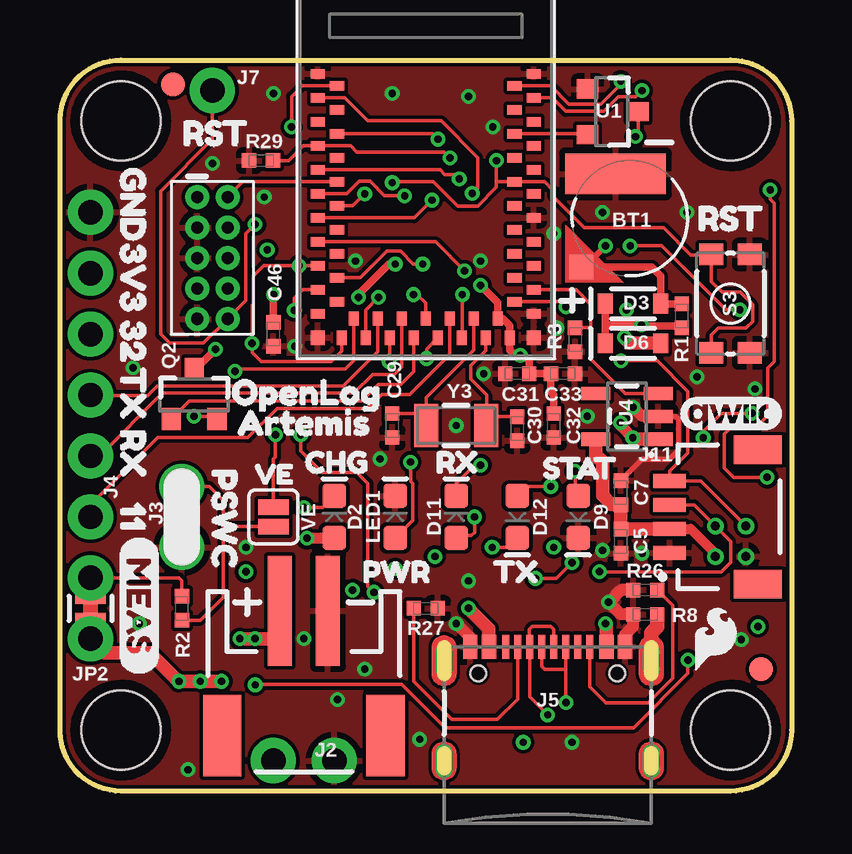
[diagram p1: board, top side]
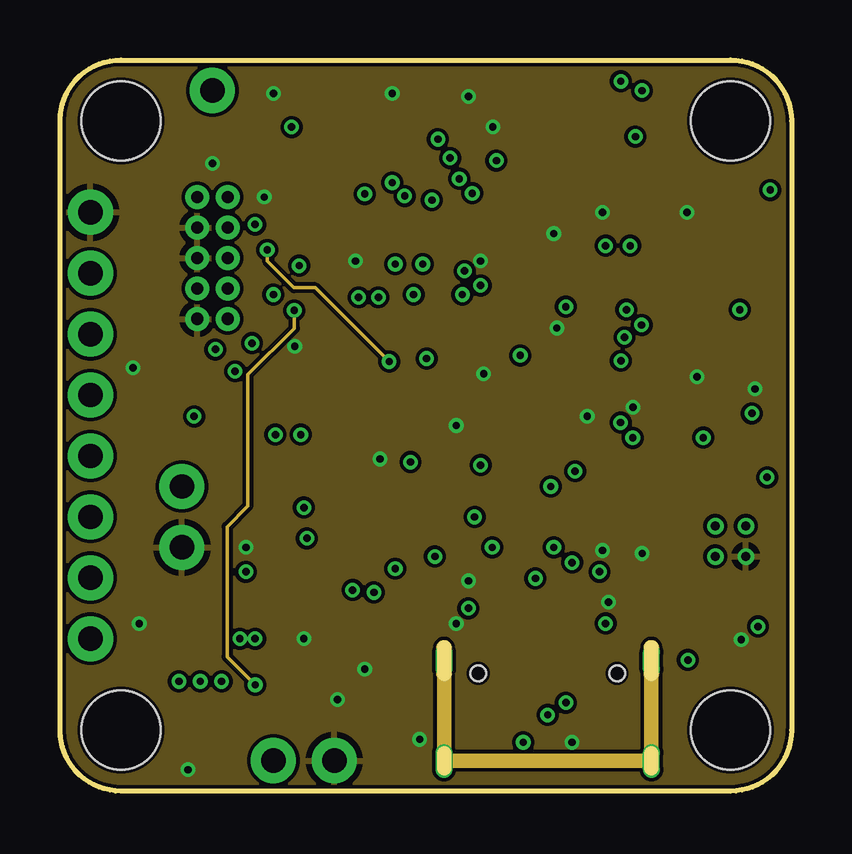
[diagram p2: board, inner layer Vertical]
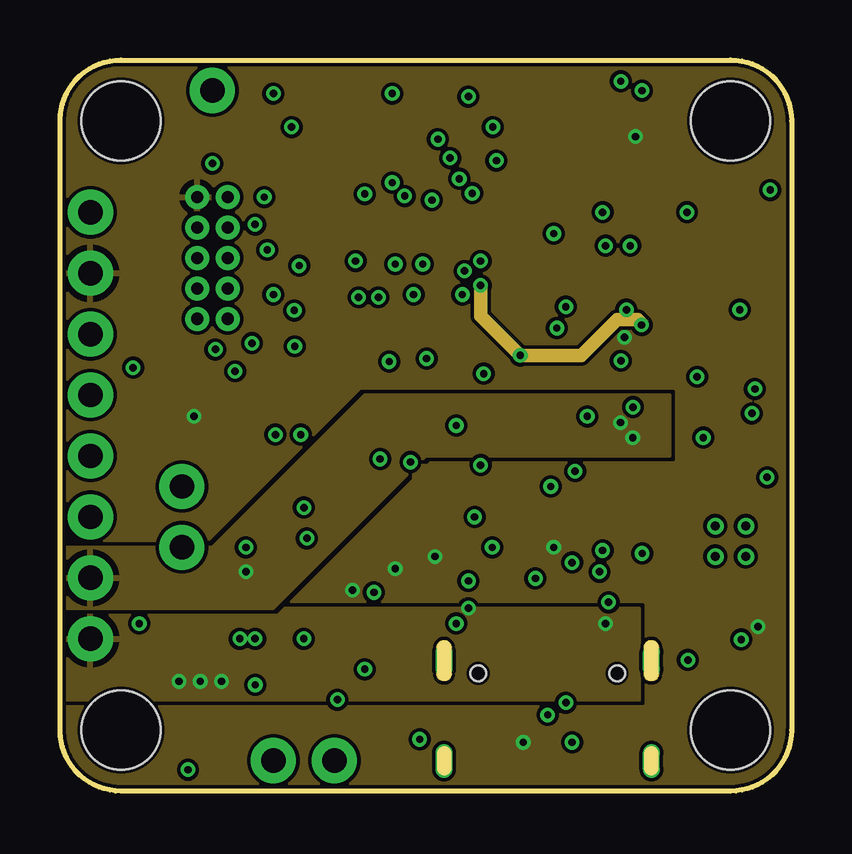
[diagram p3: board, inner layer Horz]
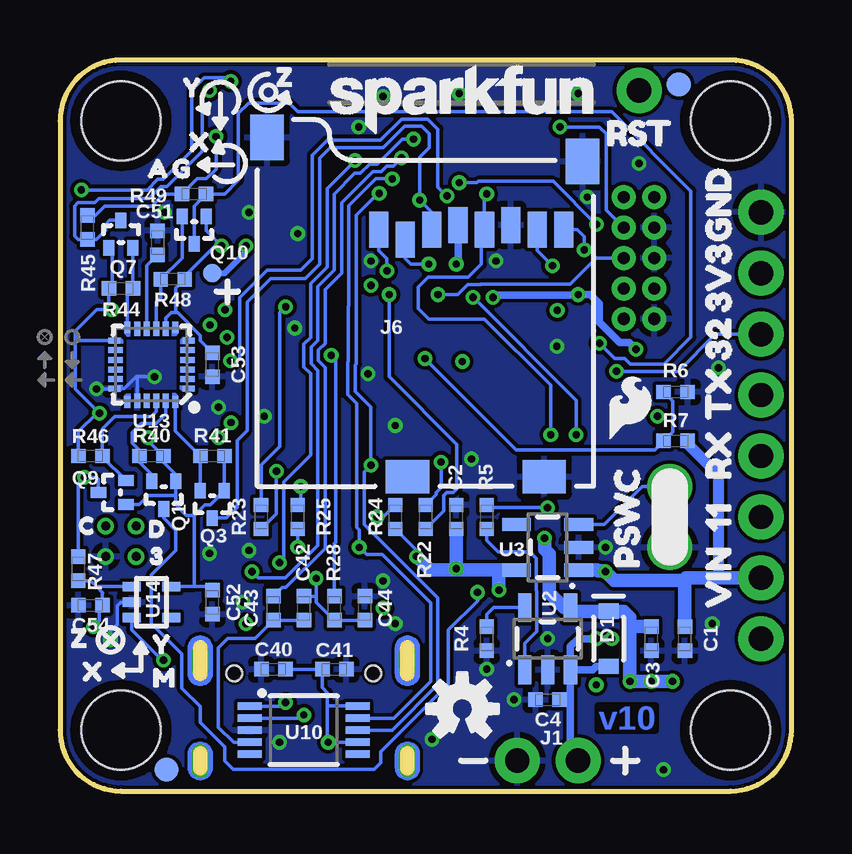
[diagram p4: board, bottom side, seen from below]

Size 30.48 x 30.48 mm. Coordinates in mm from the lower left corner, seen from the top.
Outline: 27.94,0 2.54,0 arc-90 0,2.54 0,27.94 arc-90 2.54,30.48 27.94,30.48 arc-90 30.48,27.94 30.48,2.54 arc-90 27.94,0
Copper layers (1+2*15+16): Top 0.035mm / dielectric 1.5mm / Vertical 0.035mm / dielectric 0.15mm / Horz 0.035mm / dielectric 0.2mm / Bottom 0.035mm
Design rules "SparkFun-2-layer-PCBWay-LIMIT *": minimum track width 6mil, minimum drill 0.3mm, track to track 6mil, track to pad 6mil, pad to pad 6mil, via to via 6mil, smd to smd 6mil, copper to edge 6mil, drill to drill 6mil, minimum pad ring 6mil, minimum via ring 6mil, stop-mask expansion 4mil, vias tented up to drill 25mil, thermal gap 10mil

### Footprints (pad centres in the part's own frame; a part is rotated, then mirrored left to right if it is on the bottom)
ML414H_IV01E = smd 1 x 1: + 2.022,2.032 | smd 4.2 x 1.7: - 0.6,-1.85
0402-TIGHT = smd 0.6 x 0.6: 1 -0.5,0; 2 0.5,0
SOD-323 = smd 0.63 x 0.83: A 1.15,0; C -1.15,0
LED-0603 = smd 1 x 1: A -0.877,0; C 0.877,0
FIDUCIAL-1X2 = smd 1 x 1: 1 0,0
TP_15TH = drill 0.381 pad 0.61: P$1 0,0
STAND-OFF = hole 3.302: 0,0
1X02_NO_SILK = drill 1.016 pad 1.88: 1 0,0; 2 2.54,0
JST-2-SMD = smd 1 x 4.6: 1 -1,-3.7; 2 1,-3.7 | smd 1.6 x 3.4: NC1 -3.4,1.5; NC2 3.4,1.5
1X06_NO_SILK = drill 1.016 pad 1.88: 1 0,0; 2 2.54,0; 3 5.08,0; 4 7.62,0; 5 10.16,0; 6 12.7,0
USB-C-16P_4LAYER-PADS = smd 0.3 x 1: A5 -1.25,-0.34; A6 -0.25,-0.34; A7 0.25,-0.34; A8 1.25,-0.34; B5 1.75,-0.34; B6 0.75,-0.34; B7 -0.75,-0.34; B8 -1.75,-0.34 | smd 0.6 x 1: GND -3.225,-0.34; GND2 3.225,-0.34; VBUS1 -2.45,-0.34; VBUS2 2.45,-0.34 | drill 0.4 pad 0.6 long: SHLD1 -4.318,-0.915; SHLD2 4.318,-0.915; SHLD3 -4.318,-5.095; SHLD4 4.318,-5.095 | hole 0.65: -2.89,-1.445; 2.89,-1.445
MICRO-SD-SOCKET = smd 1.8 x 1.4: CD1 -2.05,0.4; CD2 -7.75,0.4 | smd 0.8 x 1.5: CS/DAT3 -7.84,10.3; DAT1 -1.24,10.7; DAT2 -8.94,10.7; DI/CMD -6.74,10.7; DO/DAT0 -2.34,10.7; GND -3.44,10.9; SCLK -4.54,10.7; VCC -5.64,10.9 | smd 1.4 x 1.9: GND1 -13.6,14.55; GND3 -0.45,13.55
1X01_NO_SILK = drill 1.016 pad 1.88: 1 0,0
JST04_1MM_RA = smd 0.6 x 1.35: 1 -1.5,0; 2 -0.5,0; 3 0.5,0; 4 1.5,0 | smd 1.2 x 2: NC1 2.8,-3.675; NC2 -2.8,-3.675
2X5-PTH-1.27MM = drill 0.508 pad 1: 1 -2.54,-0.635; 2 -2.54,0.635; 3 -1.27,-0.635; 4 -1.27,0.635; 5 0,-0.635; 6 0,0.635; 7 1.27,-0.635; 8 1.27,0.635; 9 2.54,-0.635; 10 2.54,0.635
COMBO-JUMPER_2_NC_TRACE = smd 0.635 x 1.27: 1 -0.508,0; 2 0.508,0 | drill 1.016 pad 1.88: 3 -1.27,0; 4 1.27,0
SOT-416FL = smd 0.46 x 0.65: 1 -0.5,-1.1; 2 0.5,-1.1; 3 0,0.05
SOT23-3 = smd 0.8 x 0.9: 1 -0.95,-1; 2 0.95,-1; 3 0,1.1
TACTILE_SWITCH_SMD_4.6X2.8MM = smd 0.9 x 1: 1 -2.05,-0.8; 2 2.05,-0.8; 3 2.05,0.8; 4 -2.05,0.8
PAD.03X.03 = smd 0.762 x 0.762: P$1 0,0
SOT23-5 = smd 0.55 x 1.2: 1 -0.95,-1.3; 2 0,-1.3; 3 0.95,-1.3; 4 0.95,1.3; 5 -0.95,1.3
ARTEMIS_FP = smd 0.4 x 0.6: AD16 -4,-3.7; BOOT 1.5,4.5; D0 0.5,-4.5; D1 -0.5,-4.5; D2 -1,-3.7; D3 2,-3.7; D7 -1.5,4.5; D8 -0.5,4.5; D9 2,3.7; D10 1,3.7; D14 -5,3.7; D17 -3.5,-4.5; D36 2.5,-4.5; D38 3,-3.7; D40 2.5,4.5; D41 -2.5,-4.5; GND@1 4.5,4.5; GND@39 -5.5,-4.5; GND@47 -1.5,-4.5; GND@59 4.5,-4.5; RXI-0 3.5,4.5; SWDCK 4,3.7; SWDIO 0,3.7; TXO-0 0.5,4.5; ~AD31 -3,-3.7; ~AD35 -2,3.7; ~D4 -2.5,4.5; ~D5 -1,3.7; ~D18 -4.5,-4.5; ~D19 -5,-3.7; ~D22 -3.5,4.5; ~D23 -4,3.7; ~D24 -3,3.7; ~D27 -4.5,4.5; ~D28 -5.5,4.5; ~D37 3.5,-4.5; ~D39 3,3.7; ~D42 1.5,-4.5; ~D43 1,-3.7; ~D44 4,-3.7; ~D45 -2,-3.7; ~RST 0,-3.7 | smd 0.6 x 0.4: AD34 -6.5,-0.5; D15 -6.5,0.5; VDD@36 -5.7,-3; VDD@37 -6.5,-3.5; XI -6.5,-2.5; XO -5.7,-2; ~AD11 -5.7,-1; ~AD12 -5.7,2; ~AD13 -5.7,1; ~AD29 -6.5,-1.5; ~AD32 -5.7,3; ~AD33/SWO -5.7,0; ~D6 -6.5,3.5; ~D25 -6.5,2.5; ~D26 -6.5,1.5 | smd 0.6 x 0.6: GND@22 -6.5,4.5; GND@38 -6.5,-4.5
MSOP10 = smd 1 x 0.3: 1 -2.25,1; 2 -2.25,0.5; 3 -2.25,0; 4 -2.25,-0.5; 5 -2.25,-1; 6 2.25,-1; 7 2.25,-0.5; 8 2.25,0; 9 2.25,0.5; 10 2.25,1
QFN24-3X3-ICM-20948 = smd 0.495 x 0.25: 1 -1.552,1; 6 -1.552,-1; 13 1.552,-1; 18 1.552,1 | smd 0.6 x 0.25: 2 -1.5,0.6; 3 -1.5,0.2; 4 -1.5,-0.2; 5 -1.5,-0.6; 14 1.5,-0.6; 15 1.5,-0.2; 16 1.5,0.2; 17 1.5,0.6 | smd 0.25 x 0.495: 7 -1,-1.552; 12 1,-1.552; 19 1,1.552; 24 -1,1.552 | smd 0.25 x 0.6: 8 -0.6,-1.5; 9 -0.2,-1.5; 10 0.2,-1.5; 11 0.6,-1.5; 20 0.6,1.5; 21 0.2,1.5; 22 -0.2,1.5; 23 -0.6,1.5
SC70 = smd 0.4 x 0.75: 1 -0.65,-0.825; 2 0,-0.825; 3 0.65,-0.825; 4 0.65,0.825; 5 -0.65,0.825
SMT-JUMPER_2_NO_SILK = smd 0.635 x 1.27: 1 -0.406,0; 2 0.406,0
CRYSTAL-SMD-3.2X1.5MM = smd 1 x 1.8: P$1 -1.25,0; P$2 1.25,0

### Placement (x,y rotation side)
BT1  23.75,23.88 180 top
C1  4.45,6.35 270 bottom
C2  13.97,11.43 90 bottom
C3  5.84,6.35 270 bottom
C4  10.16,3.81 180 bottom
C5  23.37,10.41 270 top
C7  23.37,12.45 90 top
C29  13.84,15.24 90 top
C30  19.05,15.11 90 top
C31  19.05,17.4 0 top
C32  20.57,15.24 270 top
C33  20.95,17.4 0 top
C40  21.59,5.08 180 bottom
C41  19.05,5.08 0 bottom
C42  20.32,7.62 90 bottom
C43  21.59,7.62 90 bottom
C44  17.78,7.62 90 bottom
C46  8.89,19.05 270 top
C51  26.42,22.86 90 bottom
C52  24.13,7.87 270 bottom
C53  24.13,17.78 270 bottom
C54  29.21,7.75 180 bottom
D1  7.62,6.35 270 bottom
D2  11.43,11.43 90 top
D3  23.88,20.32 0 top
D6  23.88,18.67 0 top
D9  21.59,11.43 270 top
D11  16.51,11.43 90 top
D12  19.05,11.43 270 top
FD1  29.21,5.08 0 top
FD2  4.7,29.46 0 bottom
FD3  4.7,29.46 0 top
FD4  26.04,0.89 0 bottom
FRAME1  19.05,-26.67 0 top  (outside the outline)
GND  28.57,9.78 0 top
H1  2.54,2.54 0 bottom
H2  27.94,2.54 0 bottom
H3  2.54,27.94 0 bottom
H4  27.94,27.94 0 bottom
J1  8.89,1.27 180 bottom
J2  10.16,3.81 180 top
J3  5.08,12.7 270 top
J4  1.27,11.43 90 top
J5  20.32,6.35 0 top
J6  8.26,12.7 0 bottom
J7  6.35,29.21 0 top
J11  25.4,11.43 90 top
J14  6.35,22.23 270 top
JP2  1.27,7.62 90 top
LED1  13.97,11.43 90 top
LOGO1  13.72,28.83 0 bottom
LOGO2  13.72,3.43 0 bottom
LOGO3  46.99,50.8 0 top  (outside the outline)
LOGO4  27.3,6.35 0 top
LOGO5  6.73,16 0 bottom
Q1  26.16,11.81 180 bottom
Q2  5.59,16.51 0 top
Q3  24.13,11.43 180 bottom
Q7  27.94,23.75 0 bottom
Q9  28.83,12.45 90 bottom
Q10  24.89,22.86 180 bottom
QWIIC_3.3V  27.3,9.78 0 top
R1  25.91,19.81 270 top
R2  5.08,7.62 90 top
R3  21.46,18.82 90 top
R4  12.7,6.35 90 bottom
R5  12.7,11.43 90 bottom
R6  4.83,16.64 180 bottom
R7  4.83,14.61 0 bottom
R8  24.38,7.37 0 top
R22  15.24,11.43 270 bottom
R23  22.1,11.43 90 bottom
R24  16.51,11.43 270 bottom
R25  20.57,11.43 270 bottom
R26  24.38,8.38 0 top
R27  15.24,7.62 180 top
R28  19.05,7.62 90 bottom
R29  8.38,26.29 0 top
R40  26.67,13.97 0 bottom
R41  24.13,13.97 0 bottom
R44  27.94,20.95 180 bottom
R45  29.34,23.5 90 bottom
R46  29.21,13.97 180 bottom
R47  29.72,9.27 270 bottom
R48  25.78,21.34 0 bottom
R49  24.89,24.89 180 bottom
S3  27.94,20.32 90 top
SCL  28.57,11.05 0 top
SDA  27.3,11.05 0 top
TP1  24.13,21.59 0 bottom
U1  22.99,28.32 270 top
U2  10.16,6.35 0 bottom
U3  10.16,10.16 90 bottom
U4  23.62,15.62 90 top
U8  15.24,25.4 90 top
U10  20.32,2.54 0 bottom
U13  26.67,17.78 180 bottom
U14  26.67,7.87 270 bottom
U$1  [QWIIC#LOGO#JPG]  27.94,15.75 0 top
U$2  [CHG2]  9.4,13.72 0 top
U$3  [PWR0]  11.81,9.14 0 top
U$4  [RX4]  14.86,13.72 0 top
U$5  [STAT5]  19.3,13.46 0 top
U$6  [VE0]  7.37,13.21 0 top
U$7  [TX3]  17.27,9.14 0 top
U$8  [RST0]  4.19,27.43 0 top
U$9  [ARTEMIS13]  6.48,15.37 0 top
U$10  [PSWC0]  6.86,8.38 90 bottom
U$11  [PSWC0]  6.86,14.35 270 top
U$12  [RST0]  8.64,27.43 0 bottom
U$13  [C0]  29.34,11.05 0 bottom
U$14  [D0]  26.42,10.92 0 bottom
U$15  [30]  26.42,9.78 0 bottom
U$27  [MEAS3]  3.3,10.67 270 top
U$28  [OPENLOG12]  6.22,16.64 0 top
U$32  [RST9]  25.65,23.88 0 top
U$33  [VIN8]  3.05,6.73 90 bottom
U$34  [3V34]  3.05,23.75 270 top
U$35  [3V34]  3.05,19.05 90 bottom
U$36  [113]  3.05,12.95 270 top
U$37  [113]  3.05,9.91 90 bottom
U$38  [322]  3.05,20.7 270 top
U$39  [322]  3.05,16.89 90 bottom
U$40  [GND5]  3.05,27.05 270 top
U$41  [GND5]  3.05,21.84 90 bottom
U$42  [RX1]  3.05,16 270 top
U$43  [X0]  23.62,27.05 180 bottom
U$44  [Y1]  26.04,29.34 0 bottom
U$45  [Z2]  22.17,29.77 0 bottom
U$46  [G5]  26.49,25.96 0 bottom
U$47  [A4]  27.51,25.96 0 bottom
U$48  [M3]  27.3,4.73 0 bottom
U$49  [X0]  28.07,4.98 180 bottom
U$50  [Y1]  27.3,6.13 0 bottom
U$51  [Z2]  30.73,6.38 0 bottom
U$54  [RX1]  3.05,12.06 90 bottom
U$55  [TX0]  3.05,18.54 270 top
U$56  [TX0]  3.05,14.61 90 bottom
VE  8.89,11.43 270 top
Y3  16.51,15.24 180 top

### Tracks (layer width: path | path; a pad name or v marks a point on that pad's centre or on a via)
3.3V  (via drill 0.3)
  Top 0.152: U1.3 24.09,27.39 v23.98,27.29 | Q2.2 6.43,15.62 v5.59,15.62
  Top 0.559: D6.A 23.77,18.67 v23.52,18.92
  Bottom 0.152: 19.34,3.56 19.34,1.99 v19.3,2.03 v19.3,2.04 U10.7 | U10.10 18.09,3.56 19.34,3.56 | R45.2 29,24 28.61,24.38 26.66,24.38 26.15,24.89 R49.2 24.76,25.53 24.38,25.53 23.98,25.93 v23.98,27.29 | R24.2 15.62,10.03 v15.62,9.78 | R25.2 v20.57,10.16 | 19.34,3.56 19.34,4.1 19.56,4.32 C41.1 C40.1 | 27.56,8.59 U14.1 28.95,8.52 | v29.08,6.86 28.84,7.1 28.84,7.62 C54.1 28.71,8.26 28.7,8.27 28.95,8.52 | R47.2 29.2,8.77 28.95,8.52
  Bottom 0.559: U3.5 12.19,9.21 | v12.19,8.38 12.19,9.21 | 12.19,9.21 13.97,9.21 | 13.97,9.21 15.05,9.21 v15.62,9.78 | C2.1 13.97,9.21
  other vias: 13.97,9.27
  pour Horz (isolate 0.152, rank 3): 0,30.48 30.48,30.48 30.48,0 0,0
5V  (via drill 0.3)
  Top 0.457: D2.A 11.42,10.54 v10.29,10.54 | JP2.3 JP2.1
  Top 0.559: JP2.3 1.85,5.77 3.73,5.77 4.93,4.57 v6.73,4.57 | J5.VBUS1 17.87,6.77 v17.02,7.62 | J5.VBUS2 22.77,6.95 v22.73,6.99
  Bottom 0.559: 6.73,6.86 v6.73,4.57 v5.84,4.57 v4.95,4.57 | 6.73,6.86 6.73,7.24 6.99,7.5 D1.C 9.06,7.5 U2.4 9.49,7.65 10.1,8.26 10.1,9.89 10.29,10.08 v10.29,10.54 | C3.1 6.73,6.86
  pour Horz (isolate 0.152, rank 2): 0,7.62 24.13,7.62 24.13,3.81 0,3.81
!POWER_LOSS!
  Top 0.152: U8.D3 21.96,27.4 U1.2
ARTEMIS_!RESET  (via drill 0.3)
  Top 0.152: v8.13,23.62 7.75,23.24 7.75,20.45 J14.10 5.97,18.67 4.57,18.67 4.19,19.05 4.19,25.02 6.35,27.18 J7.1 | v13.84,25.37 13.88,25.4 15.56,25.4 16.57,24.39 17.4,24.39 18.18,25.18 18.18,25.4 | S3.4 27.14,19.01 27.43,19.3 28.57,19.3 28.85,19.58 28.85,20.29 28.34,20.8 27.59,20.8 27.14,21.25 S3.3 27.12,22.35 26.29,22.35 25.15,23.5 21.84,23.5 20.52,24.82 20.52,25.08 20.19,25.4 U8.~RST 18.18,25.4 | v18.18,26.29 18.18,25.4 | v21.34,9.53 20.68,8.87 v19.81,8.87
  Bottom 0.152: C44.1 R28.1 19.81,7.87 19.81,8.13 | v13.84,25.37 13.11,25.37 13.05,25.43 9.93,25.43 v8.13,23.62 | v21.34,9.53 21.16,9.7 21.16,12.88 20.04,14 20.04,17.41 20.32,17.69 20.32,18.63 20.04,18.91 20.04,21.16 19.36,21.84 19.36,25.11 v18.18,26.29 | 19.81,8.13 v19.81,8.87 | C42.2 19.81,8.12 19.81,8.13
ARTEMIS_!RTS!
  Bottom 0.152: U10.4 23.25,2.04 23.88,2.67 23.88,5.97 23.49,6.36 22.35,6.36 C43.1 C42.1
ARTEMIS_BOOT  (via drill 0.3)
  Top 0.152: v16.26,26.39 16,26.65 12.37,26.65 12.12,26.9 U8.BOOT 10.14,26.9 9.53,26.29 R29.2
  Bottom 0.152: v16.26,26.39 16.59,26.06 16.86,26.06 17.09,25.83 17.45,25.83 18.75,24.54 18.75,21.59 19.43,20.91 19.43,18.66 19.71,18.38 19.71,17.94 19.43,17.66 19.43,10.12 21.07,8.48 21.23,8.48 C43.2
ARTEMIS_RX0  (via drill 0.3)
  Top 0.152: v17.53,13.59 17.27,13.59 16.51,12.83 D11.C | U8.RXI-0 11.87,28.9 12.83,27.94 15.88,27.94 17.4,26.42 17.4,25.15 v17.18,24.92
  Bottom 0.152: U10.8 16.64,2.54 14.73,4.45 14.73,8.05 17.8,11.12 17.8,13.3 v17.53,13.58 v17.53,13.59 17.53,16 18.19,16.66 18.19,17.75 18.14,17.8 18.14,24 17.22,24.92 v17.18,24.92
ARTEMIS_SWDCK  (via drill 0.3)
  Top 0.152: U8.SWDCK 10.1,29.4 9.65,28.96 v9.65,27.69
  Bottom 0.152: J14.4 7,23.5 7.71,24.21 7.71,27.4 8,27.69 v9.65,27.69
ARTEMIS_SWDIO
  Top 0.152: J14.2 7.62,25.4 U8.SWDIO
ARTEMIS_TX0  (via drill 0.3)
  Top 0.152: U8.TXO-0 15.84,25.9 16.04,25.71 16.46,25.71 v16.64,25.53 | v18.01,10.16 18.66,10.16 D12.C
  Bottom 0.152: U10.9 16.57,3.04 15.04,4.57 15.04,7.84 17.05,9.86 17.7,9.86 v18.01,10.16 18.01,10.9 18.11,11 18.11,16.16 18.49,16.54 18.49,17.88 18.47,17.91 18.47,20.19 18.44,20.22 18.44,24.41 17.32,25.53 v16.64,25.53
ARTEMIS_~AD11
  Top 0.152: U8.~AD11 16.24,18.2 14.57,16.52 13.4,16.52 12.83,15.95 9.05,15.95 7.83,14.73 4.06,14.73 1.27,11.94 J4.1
ARTEMIS_~AD12/TX1
  Top 0.152: U8.~AD12 13.24,18.32 11.81,16.89 4.05,16.89 3.65,16.49 1.29,16.49 J4.3
ARTEMIS_~AD13/RX1
  Top 0.152: J4.2 1.65,13.97 4.27,16.59 12.25,16.59 13.04,17.37 13.94,17.37 14.25,17.69 14.25,18.13 14.24,18.14 U8.~AD13
ARTEMIS_~AD32  (via drill 0.3)
  Top 0.152: U8.~AD32 12.24,17.95 11.89,17.6 7.4,17.6 v7.3,17.5
  Bottom 0.152: v7.3,17.5 4.72,17.5 3.17,19.05 J4.4
CC3
  Top 0.152: R26.2 25.53,7.74 25.53,4.7 24.51,3.68 22.73,3.68 22.07,4.35 J5.B5
CC4
  Top 0.152: R27.2 14.74,4.56 16.32,2.98 18.22,2.98 19.07,3.83 J5.A5
CHG_LED
  Bottom 0.152: R5.1 12.7,10.45 12.22,9.97 10.89,9.97 10.63,9.71 10.63,8.37 10.61,8.35 10.61,6.67 11.11,6.16 U2.1
D+2  (via drill 0.3)
  Top 0.152: v21.08,3.68 21.07,3.69 21.07,5.08 | J5.B6 21.07,5.08 | J5.A6 20.07,5.2 20.19,5.08 21.07,5.08
  Bottom 0.152: U10.1 21.23,3.54 v21.08,3.68
D-2  (via drill 0.3)
  Top 0.152: J5.A7 20.57,6.74 20.45,6.86 19.68,6.86 19.56,6.73 19.56,6.02 J5.B7 19.57,3.92 v20.32,3.17
  Bottom 0.152: U10.2 20.45,3.04 v20.32,3.17
DAT1  (via drill 0.3)
  Top 0.152: U8.~D26 13.74,17.93 v13.72,17.91
  Vertical 0.152: v13.72,17.91 10.63,20.99 9.74,20.99 8.64,22.1 v8.64,22.56
  Bottom 0.152: v8.64,22.56 8.64,23.11 8.92,23.4 J6.DAT1
DAT2  (via drill 0.3)
  Top 0.152: U8.~D4 15.65,22.9 v16.86,21.69
  Bottom 0.152: v16.86,21.69 16.86,22.19 17.2,22.53 J6.DAT2
GND  (via drill 0.3)
  Top 0.203: C7.2 24.27,13.84 25.4,13.84 25.78,14.22 25.78,15.49 25.65,15.62 U4.2
  Top 0.457: U4.2 24.26,15.62 v23.88,16
  Top 0.508: J5.GND2 23.55,6.53 23.88,6.87 R8.1 23.37,7.37 v22.86,7.87 23.37,8.38 R26.1 | J5.GND 17.09,6.4 v16.51,6.99
  Bottom 0.152: 27.3,17.27 27.8,16.78 U13.18 28.24,16.76 v28.96,16.76 | 27.3,17.27 v26.54,17.27 | U13.20 27.27,17.24 27.3,17.27 | U14.2 27.94,7.87 28.1,7.71 28.1,6.95 28.38,6.67 v28.38,6.32
  other vias: 9.78,18.54 12.32,22.1 16.51,15.24 17.65,17.4 17.53,22.1 13.84,29.08 8.89,29.08 6.35,26.16 13.34,13.84 7.75,10.16 10.16,6.35 11.56,3.81 12.7,5.08 3.3,6.99 21.34,2.03 17.02,8.76 18.03,27.69 22.61,24.13 26.12,24.13 21.97,15.62 20.7,19.3 17.02,28.96 20.57,23.24 24.26,9.91 22.61,10.03 8.51,24.77 3.05,17.65 5.33,0.89 14.99,2.16
  pour Top (isolate 0.152, rank 6): 0,0 0,30.48 30.48,30.48 30.48,0
  pour Bottom (isolate 0.152, rank 6): 30.48,0 30.48,30.48 0,30.48 0,0
  pour Vertical (isolate 0.152): 0,30.48 30.48,30.48 30.48,0 0,0
ICM-20948-LV_!CS!
  Bottom 0.152: U13.22 26.47,15.82 26.67,15.62 28.19,15.62 28.71,15.11 R46.1 28.71,13.93 Q9.2
ICM-20948-LV_#_1.8V  (via drill 0.3)
  Top 0.152: v26.8,14.74 26.8,14.99 27.56,15.75 v28.83,15.75 | v28.32,20.07 27.73,20.07 25.06,22.73 v23.76,22.73
  Bottom 0.152: Q7.1 28.31,22.52 28.31,21.08 R44.2 28.44,20.18 v28.32,20.07 28.96,20.07 29.84,19.18 29.84,18.8 | Q10.1 24.39,23.37 v23.76,22.73 24.01,22.73 25.28,21.46 R48.2 25.65,20.96 25.65,19.94 | U14.5 24.89,8.52 | 25.66,12.32 25.66,11.95 25.21,11.49 24.89,11.49 | 25.66,12.32 Q1.1 25.66,13.21 26.17,13.72 R40.2 26.8,14.6 v26.8,14.74 | R46.2 29.71,14.99 28.95,15.75 v28.83,15.75 29.84,16.76 29.84,18.8 | C53.1 24.64,18.79 24.64,19 25.58,19.94 25.65,19.94 | U13.8 26.07,19.72 25.85,19.94 25.65,19.94 | R41.2 Q3.1 24.23,11.93 24.45,11.93 24.89,11.49 | U13.13 29.83,18.78 29.84,18.8 | 24.89,11.49 24.89,8.52 | Q9.1 27.17,11.95 26.8,12.32 25.66,12.32 | C52.1 24.28,8.52 24.89,8.52
ICM-20948-LV_INT
  Bottom 0.152: U13.12 27.67,20.84 27.56,20.95 R44.1 Q7.2
ICM-20948-LV_SCK
  Bottom 0.152: Q1.2 26.66,13.21 27.17,13.72 R40.1 27.17,14.22 27.46,14.52 27.46,14.96 27.1,15.32 26.47,15.32 26.07,15.71 U13.23
ICM-20948-LV_SDI
  Bottom 0.152: U13.24 25.67,15 R41.1 | R41.1 | Q3.2 R41.1
ICM-20948-LV_SDO
  Bottom 0.152: U13.9 26.47,20.39 26.28,20.58 R48.1 25.39,22.23 Q10.2
ICM_!CS!  (via drill 0.3)
  Top 0.152: v29.59,25.06 29.59,24.68 29.76,24.5 29.76,17.9 29.49,17.63 29.49,15.65 29.05,15.21 28.01,15.21 27.69,14.89 27.69,13.46 28.07,13.08 v29.46,13.08 | U8.~D44 20.45,29.4 21.2,28.64 22.53,28.64 23.37,29.48 v23.37,29.59
  Bottom 0.152: v23.37,29.59 23.51,29.74 24.47,29.74 24.99,29.22 24.99,26.7 26.19,25.5 26.41,25.5 26.85,25.06 v29.59,25.06 | Q9.3 28.88,13 28.96,13.08 v29.46,13.08 29.72,12.83 R47.1
ICM_INT  (via drill 0.3)
  Top 0.152: v24.25,29.2 24,28.95 23.27,28.95 22.66,28.34 21.07,28.34 20.5,28.9 U8.~D37
  Bottom 0.152: v24.25,29.2 24.55,28.9 24.55,26.67 26.03,25.2 26.28,25.2 26.79,24.69 28.87,24.69 29.03,24.52 29.73,24.52 29.87,24.39 29.87,23.14 29.73,23 R45.1 28.97,23 28.77,23.2 28.74,23.2 28.57,23.37 28.57,23.62 28.4,23.8 Q7.3
ICM_PWR  (via drill 0.3)
  Top 0.152: v26.16,5.46 26.16,4.9 23.9,2.64 16.05,2.64 14.25,4.45 8.14,4.45 v8.14,4.43 | U8.~D27 10.11,20.9 9.76,20.55 v9.76,20.04
  Vertical 0.152: v8.14,4.43 6.96,5.6 6.96,11.02 7.83,11.89 7.83,17.36 9.76,19.29 v9.76,20.04
  Bottom 0.152: v26.16,5.46 26.24,5.46 27.5,6.72 U14.3
MICROSD_!CS!  (via drill 0.3)
  Top 0.152: v15.11,21.97 14.72,21.97 14.19,22.5 13.62,22.5 12.52,21.4 U8.~D23
  Bottom 0.152: v15.11,21.97 15.88,21.97 16.09,22.19 J6.CS/DAT3
MICROSD_PWR
  Top 0.152: Q2.1 5.38,16.26 12.57,16.26 13.26,16.94 14.19,16.94 14.74,17.49 U8.D15
N$1
  Top 0.61: R8.2 24.88,6.85 24.64,6.6 J5.SHLD2
  Vertical 0.61: J5.SHLD2 J5.SHLD4 J5.SHLD3 J5.SHLD1
N$7
  Bottom 0.152: R4.2 12.7,7.37 12.42,7.65 U2.5
N$11  (via drill 0.3)
  Top 0.152: D2.C 10.94,11.81 v10.16,11.81
  Bottom 0.152: v10.16,11.81 12.59,11.81 R5.2
N$20
  Top 0.152: U8.XO 17.24,18.38 15.26,16.4 15.26,15.62 | Y3.P$2 15.26,15.62 | C29.2 15.14,15.74 15.26,15.62
N$21
  Top 0.152: Y3.P$1 17.74,15.26 17.74,15.49 17.78,15.53 17.78,15.62 | U8.XI 17.74,18.37 17.12,17.75 17.12,17.17 17.78,16.51 17.78,15.62 | C30.2 17.79,15.61 17.78,15.62
N$24  (via drill 0.3)
  Top 0.152: v14.61,13.72 14.61,12.91 14.7,12.81 14.7,11.28 LED1.A
  Bottom 0.152: R22.1 14.8,12.37 14.8,12.45 14.61,12.65 v14.61,13.72
N$25  (via drill 0.3)
  Top 0.152: v21.46,13.34 21.46,12.43 D9.A
  Bottom 0.152: R23.1 21.46,11.56 v21.46,13.34
N$26  (via drill 0.3)
  Top 0.152: D12.A 19.44,12.7 v20.45,12.7
  Bottom 0.152: v20.45,12.7 20.45,12.06 R25.1
N$27  (via drill 0.3)
  Top 0.152: D11.A 16.51,10.66 17.14,10.66 17.27,10.79 v17.27,11.43
  Bottom 0.152: v17.27,11.43 17.02,11.43 R24.1
N$30
  Bottom 0.152: U13.10 26.87,21.91 C51.1
PWR_LED  (via drill 0.3)
  Top 0.152: v16.76,20.7 16.76,18.92 U8.~AD29
  Bottom 0.152: v16.76,20.7 16.76,17.27 13.95,14.45 13.95,12.6 14.08,12.46 14.37,12.46 14.5,12.32 14.5,11.67 R22.2
QWIIC_3.3V
  Top 0.406: J11.2 26.28,10.93 27.3,9.91 QWIIC_3.3V.P$1
  Top 0.559: U4.5 22.32,14 22.61,13.72 22.61,12.32 22.98,11.95 C7.1 C5.1 23.38,10.92 J11.2
QWIIC_PWR
  Top 0.152: U8.~D18 21.5,20.9 22.12,20.29 22.12,19.3 | 22.12,19.3 22.12,18.01 23.56,16.57 U4.3 | R3.2 22.1,19.32 22.12,19.3
RTC_BAT+  (via drill 0.3)
  Top 0.254: v22.73,22.73 21.84,21.84
  Top 0.305: BT1.+ 21.84,21.84 24.65,21.84 25.03,21.47 D3.A R1.1
  Bottom 0.254: v22.73,22.73 22.73,22.48 23.62,21.59 TP1.P$1
SCK  (via drill 0.3)
  Top 0.152: v12.7,24.89 12.21,24.4 U8.~D5 | v13.08,8.28 12.83,8.53 12.83,12.83 12.37,13.28 10.92,13.28 10.03,14.17 v10.03,14.86
  Bottom 0.152: v12.7,24.89 12.79,24.8 J6.SCLK 12.92,23.27 12.92,21.96 13.46,21.42 15.15,21.42 15.55,21.02 15.55,20.13 15.11,19.68 12.8,19.68 10.03,16.92 v10.03,14.86 | v13.08,8.28 13.08,7.94 14.3,6.72 14.3,4.45 17.11,1.64 17.11,1.18 17.38,0.91 23.26,0.91 23.62,1.27 23.62,1.85 24.64,2.87 24.64,3.52 25.4,4.29 25.4,5.71 26.67,6.99 26.67,9.02 25.65,10.03 25.65,10.87 26.16,11.38 Q1.3
SCL  (via drill 0.3)
  Top 0.152: U8.D8 11.95,24.9 12.48,25.43 12.93,25.43 13.52,24.83 14.34,24.83 v14.36,24.81 | v23.37,17.94 24.88,17.94 26.16,16.66 26.16,14.1 25.4,13.34 J11.4 26.69,12.93 SCL.P$1
  Bottom 0.152: v14.36,24.81 14.73,25.18 14.73,27.6 15.15,28.02 16.25,28.02 17.14,27.13 19.35,27.13 19.96,26.52 19.96,22.2 20.45,21.72 21.84,21.72 22.99,20.57 22.99,18.03 23.08,17.94 v23.37,17.94
SD_PWR  (via drill 0.3)
  Top 0.305: v12.44,20.58 12.44,20.71 13.7,21.97 v13.97,21.97 | v6.48,18.41 5.67,17.61 Q2.3 | C46.1 v8.89,20.7
  Bottom 0.305: v13.97,21.97 13.89,22.05 J6.VCC | v6.48,18.41 6.76,18.7 7.16,18.7 8,19.54 8,20.32 8.38,20.7 v8.89,20.7 8.9,20.69 12.34,20.69 v12.44,20.58
SDA  (via drill 0.3)
  Top 0.152: U8.D9 15.53,27.4 v15.75,27.18 | J11.3 26.42,11.93 SDA.P$1 27.94,10.41 27.94,9.53 27.56,9.14 v22.48,9.14
  Bottom 0.152: v15.75,27.18 16.22,27.18 17.27,26.14 17.58,26.14 17.96,25.75 18.19,25.75 19.05,24.89 19.05,21.72 19.74,21.03 19.74,18.79 20.02,18.51 20.02,17.81 19.74,17.53 19.74,10.24 21.09,8.89 22.23,8.89 v22.48,9.14
SDI  (via drill 0.3)
  Top 0.152: U8.~D6 11.74,18.34 11.3,17.91 8.38,17.91 8,18.29 v8,18.67 8,20.27 8.05,20.32 8.05,21.46 8.49,21.9 v9.97,21.9 U8.~D22
  Bottom 0.152: Q10.3 24.89,24.39 R49.1 23.62,24.89 23.05,25.46 23.05,28.26 22.62,28.68 20.93,28.68 20.57,28.32 7.49,28.32 4.19,25.02 4.19,18.92 5.31,17.8 6.72,17.8 6.95,18.03 7.37,18.03 v8,18.67 | v9.97,21.9 10.6,22.53 J6.DO/DAT0
SDO  (via drill 0.3)
  Top 0.152: v15.49,24.64 14.76,23.9 U8.D7
  Bottom 0.152: J6.DI/CMD 14.99,24.14 v15.49,24.64 15.49,26.43 15.09,26.83 15.09,27.4 15.4,27.71 16.12,27.71 17.01,26.82 19.23,26.82 19.66,26.39 19.66,21.97 20.27,21.36 21.7,21.36 22.68,20.38 22.68,15.04 23.1,14.62 23.1,11.82 23.55,11.38 Q3.3
STATLED  (via drill 0.3)
  Top 0.152: v21.08,20.19 20.87,20.4 U8.~D19
  Bottom 0.152: R23.2 22.1,13.59 21.33,14.36 21.33,19.94 v21.08,20.19
SWO  (via drill 0.3)
  Top 0.152: U8.~AD33/SWO 15.24,20.34 14.87,20.7 v14.73,20.7
  Bottom 0.152: v14.73,20.7 13.9,20.7 13.49,21.12 12.96,21.12 12.94,21.13 9.22,21.13 8.13,22.23 J14.6
V_BATT  (via drill 0.3)
  Top 0.152: J2.2 9.16,6.49 9.02,6.35
  Top 0.559: 9.02,6.35 v8.13,6.35 v7.49,6.35
  Bottom 0.152: D1.A
  Bottom 0.305: U2.3 9.21,3.81 | 9.21,3.81 9.21,1.59 J1.1 | C4.1 9.21,3.81 | U2.3 8.29,5.05 8.13,5.21 D1.A | U2.3 9.21,6.03 8.89,6.35 v8.13,6.35 v7.49,6.35
VCC_1  (via drill 0.3)
  Top 0.305: R1.2 25.91,19.39 24.28,19.39 v24.23,19.43 23.87,19.43 23.77,19.53 23.62,19.53 | D3.C 22.73,19.43 | 22.73,19.43 D6.C | C32.1 20.57,16.51 20.45,16.63 C33.1 C31.2 19.55,17.94 19.33,18.16 v19.18,18.16 18.97,18.16 18.74,18.39 U8.VDD@37 18.74,19.41 18.45,19.7 U8.VDD@36 18.24,20.37 v17.53,21.08 | 23.62,19.53 23.27,19.53 23.17,19.43 22.73,19.43 | v23.6,20.07 23.6,19.55 23.62,19.53
  Horz 0.305: 23.6,19.68 23.62,19.65
  Horz 0.559: v24.23,19.43 24.23,19.5 24.08,19.65 23.62,19.65 23.21,19.65 21.72,18.16 v19.18,18.16 17.53,19.81 v17.53,21.08 | v23.6,20.07 23.6,19.68
  Bottom 0.152: R28.2 19.05,10.31 19,10.36 19,17.98 v19.18,18.16
VIN  (via drill 0.3)
  Top 0.152: JP2.4 4.95,8.89 5.08,8.76 R2.2
  Top 0.457: JP2.2 JP2.4 | v23.36,15.36 23.36,15.23 v23.86,14.73
  Top 0.559: U4.1 23.92,14.67 v23.86,14.73
  Bottom 0.457: R7.2 4.33,14.48 3.05,13.2 3.05,8.89
  Bottom 0.559: JP2.4 3.05,8.89 4.41,8.89 4.51,8.79 | 4.51,8.79 4.45,8.79 C1.1 | 4.51,8.79 7.39,8.79 v7.75,9.14 7.75,9.17 8.05,9.17 8.09,9.21 U3.1
  pour Horz (isolate 0.152): 0,7.62 8.89,7.62 15.24,13.97 25.4,13.97 25.4,16.51 12.7,16.51 6.35,10.16 0,10.16
VIN/3  (via drill 0.3)
  Top 0.152: U8.AD34 15.27,18.43 v15.27,18.03
  Bottom 0.152: v15.27,18.03 11.46,14.22 5.71,14.22 R7.1 4.95,14.98 4.95,16.26 R6.2
VREG_EN
  Top 0.152: J3.1 6.21,12.7 6.81,12.11 6.81,11.05 | R2.1 5.85,7.12 6.81,8.08 6.81,11.05 | VE.2 6.83,11.02 6.81,11.05
  Bottom 0.152: U3.3 7.81,11.11 6.22,12.7 J3.1
VREG_EN1  (via drill 0.3)
  Top 0.152: U8.~D25 12.74,20.06 v13.27,20.58 | v8.97,14.86 8.97,13.93 8.89,13.84 VE.1
  Bottom 0.152: v8.97,14.86 8.97,16.29 v13.27,20.58

### Text on the board
Bottom: v10
Measures: Units in inches
tDocu: 4-layer board | 1.6mm thickness | ENIG finish | N. Seidle